# EAGLE design STM32_esc (EAGLE 9.6.2)
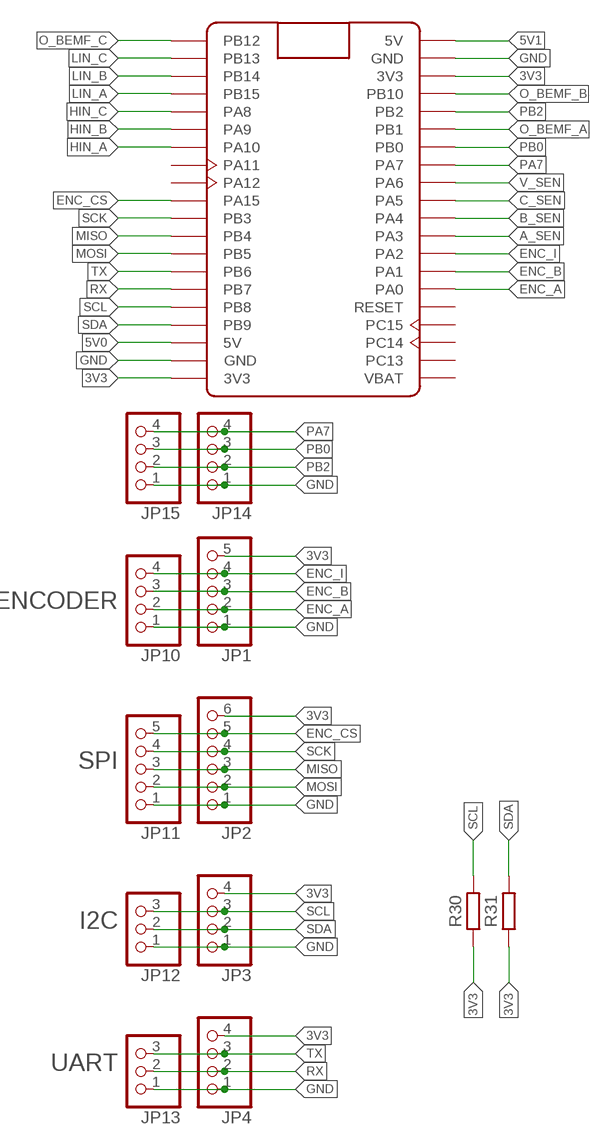
[diagram p0: schematic, sheet 1, part 1 of 2]
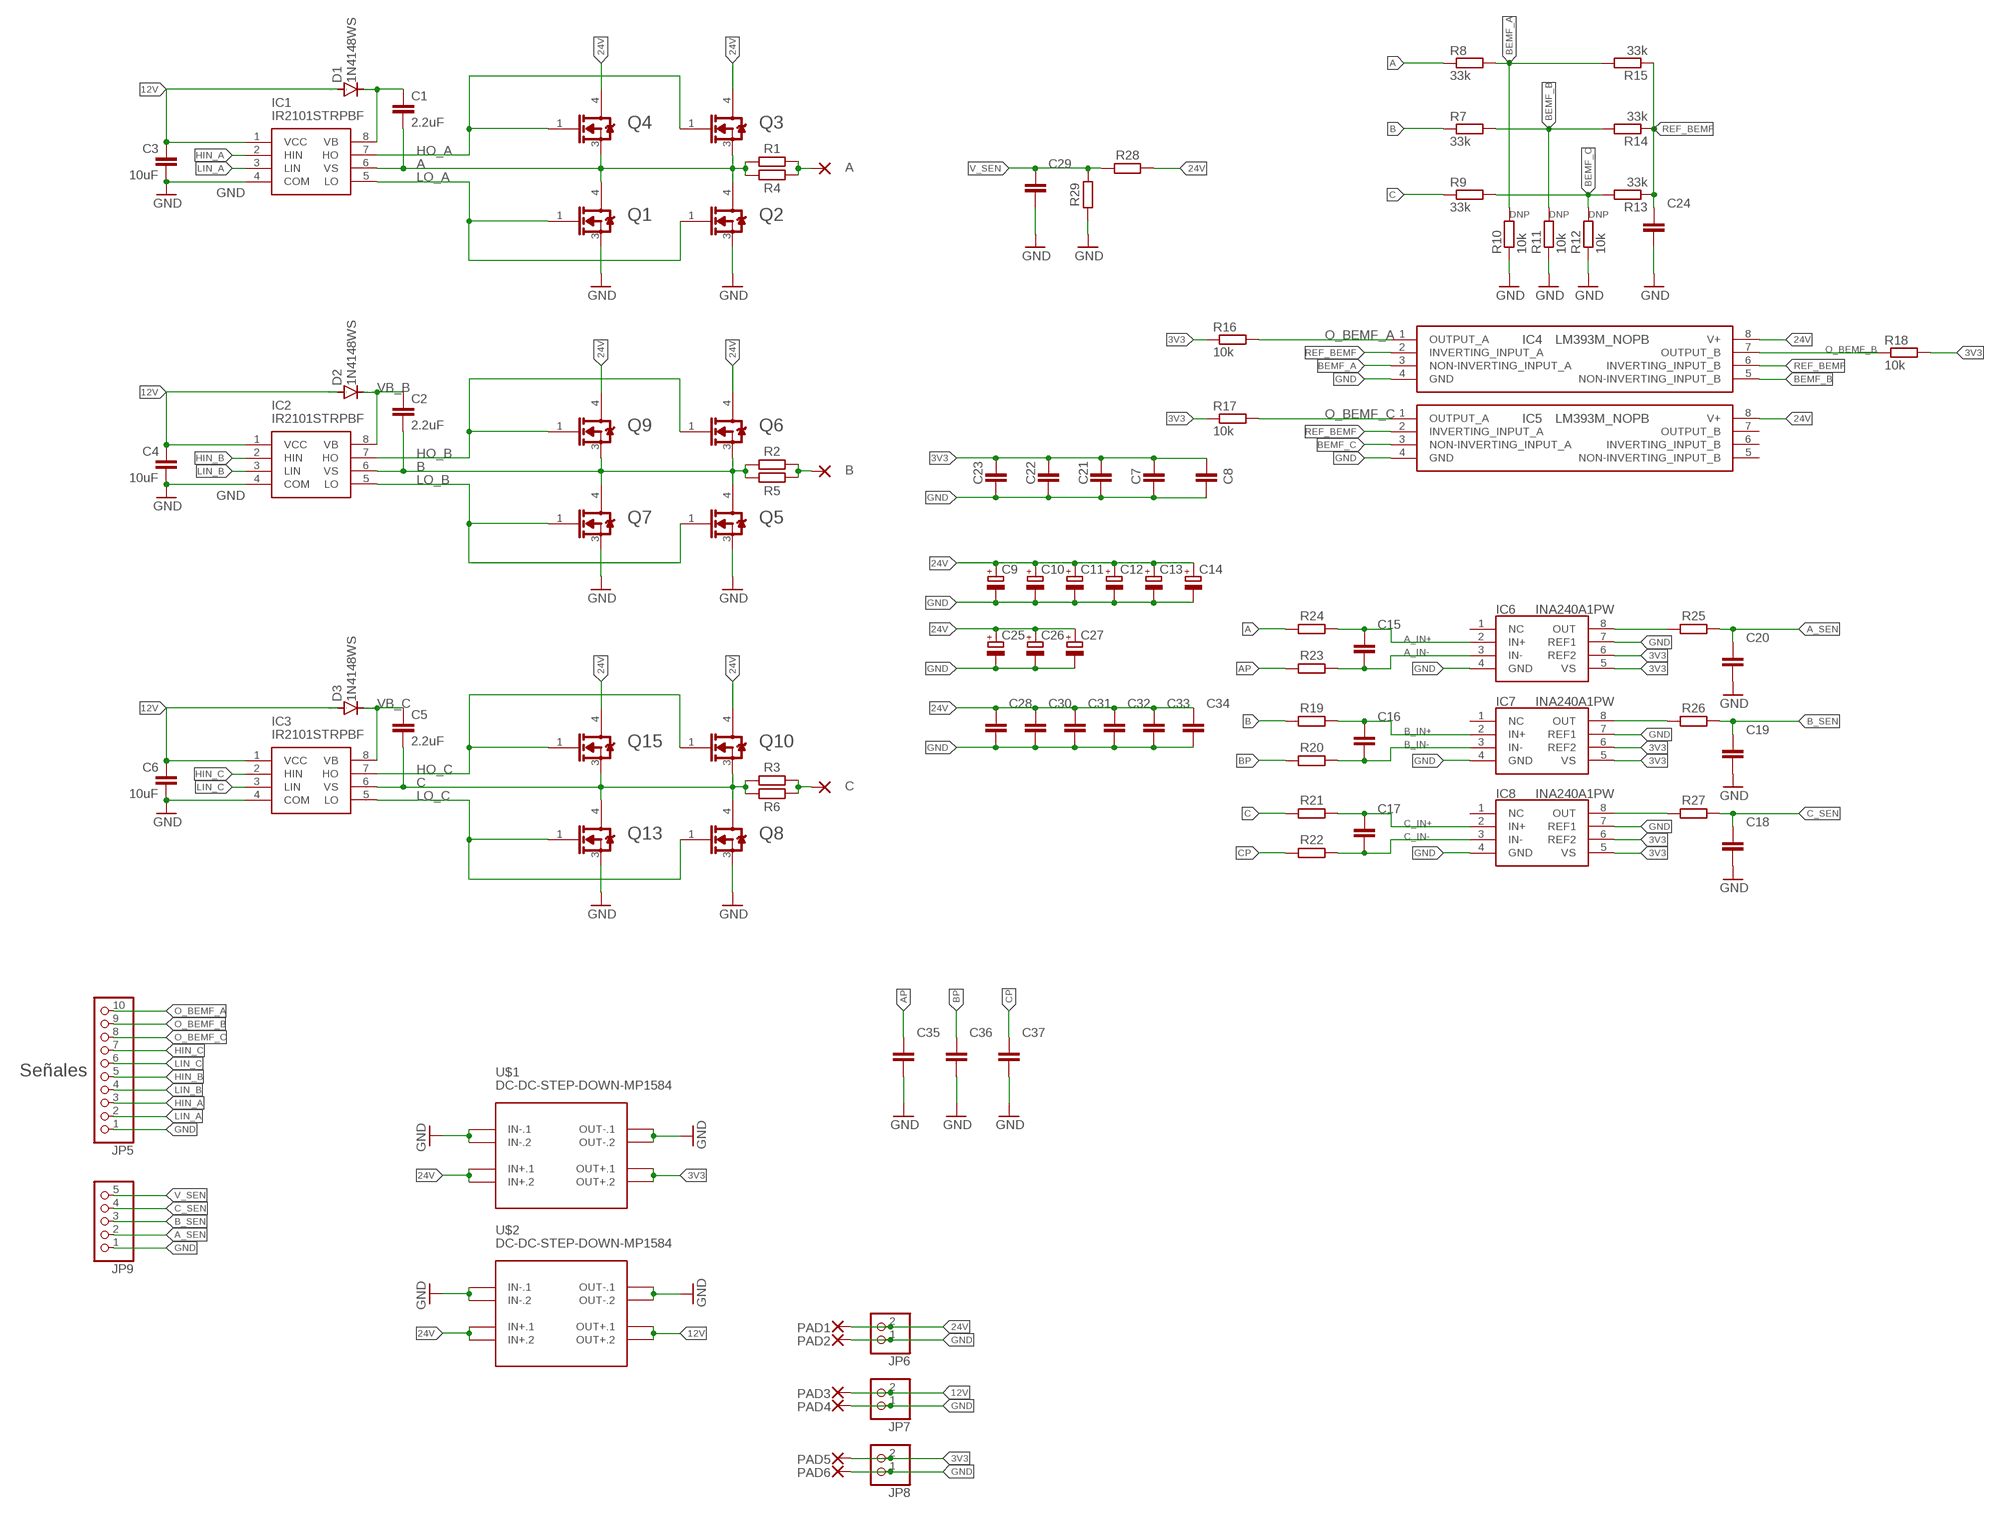
[diagram p1: schematic, sheet 1, part 2 of 2]

## Parts
A  SMD5  [SMD2,54-5,08]
B  SMD5  [SMD2,54-5,08]
C  SMD5  [SMD2,54-5,08]
C1  2.2uF  C_CHIP-1206(3216-METRIC)  [CAPC3216X135]
C2  2.2uF  C_CHIP-1206(3216-METRIC)  [CAPC3216X135]
C3  10uF  C_CHIP-1206(3216-METRIC)  [CAPC3216X135]
C4  10uF  C_CHIP-1206(3216-METRIC)  [CAPC3216X135]
C5  2.2uF  C_CHIP-1206(3216-METRIC)  [CAPC3216X135]
C6  10uF  C_CHIP-1206(3216-METRIC)  [CAPC3216X135]
C7  C_CHIP-0603(1608-METRIC)  [0603]
C8  C_CHIP-0603(1608-METRIC)  [0603]
C9  C-POL_TANTALUM-2917(7343-METRIC)  [CAPMP7343X310N]
C10  C-POL_TANTALUM-2917(7343-METRIC)  [CAPMP7343X310N]
C11  C-POL_TANTALUM-2917(7343-METRIC)  [CAPMP7343X310N]
C12  C-POL_TANTALUM-2917(7343-METRIC)  [CAPMP7343X310N]
C13  C-POL_TANTALUM-2917(7343-METRIC)  [CAPMP7343X310N]
C14  C-POL_TANTALUM-2917(7343-METRIC)  [CAPMP7343X310N]
C15  C_CHIP-0603(1608-METRIC)  [0603]
C16  C_CHIP-0603(1608-METRIC)  [0603]
C17  C_CHIP-0603(1608-METRIC)  [0603]
C18  C_CHIP-0603(1608-METRIC)  [0603]
C19  C_CHIP-0603(1608-METRIC)  [0603]
C20  C_CHIP-0603(1608-METRIC)  [0603]
C21  C_CHIP-0603(1608-METRIC)  [0603]
C22  C_CHIP-0603(1608-METRIC)  [0603]
C23  C_CHIP-0603(1608-METRIC)  [0603]
C24  C_CHIP-0603(1608-METRIC)  [0603]
C25  C-POL_ECAP-10.5MM  [CAPAE1030X1050N]
C26  C-POL_ECAP-10.5MM  [CAPAE1030X1050N]
C27  C-POL_ECAP-10.5MM  [CAPAE1030X1050N]
C28  C_CHIP-1206(3216-METRIC)  [1206]
C29  C_CHIP-0603(1608-METRIC)  [0603]
C30  C_CHIP-1206(3216-METRIC)  [1206]
C31  C_CHIP-1206(3216-METRIC)  [1206]
C32  C_CHIP-1206(3216-METRIC)  [1206]
C33  C_CHIP-1206(3216-METRIC)  [1206]
C34  C_CHIP-1206(3216-METRIC)  [1206]
C35  C_CHIP-1206(3216-METRIC)  [1206]
C36  C_CHIP-1206(3216-METRIC)  [1206]
C37  C_CHIP-1206(3216-METRIC)  [1206]
D1  1N4148WS  1N4446  [DO35-10]
D2  1N4148WS  1N4446  [DO35-10]
D3  1N4148WS  1N4446  [DO35-10]
IC1  IR2101STRPBF  [SOIC127P600X175-8N]
IC2  IR2101STRPBF  [SOIC127P600X175-8N]
IC3  IR2101STRPBF  [SOIC127P600X175-8N]
IC4  LM393M_NOPB  [SOIC127P600X175-8N]
IC5  LM393M_NOPB  [SOIC127P600X175-8N]
IC6  INA240A1PW  [SOP65P640X120-8N]
IC7  INA240A1PW  [SOP65P640X120-8N]
IC8  INA240A1PW  [SOP65P640X120-8N]
JP1  PINHD-1X5  [1X05]
JP2  PINHD-1X6  [1X06]
JP3  PINHD-1X4  [1X04]
JP4  PINHD-1X4  [1X04]
JP5  PINHD-1X10  [1X10]
JP6  PINHD-1X2  [1X02]
JP7  PINHD-1X2  [1X02]
JP8  PINHD-1X2  [1X02]
JP9  PINHD-1X5  [1X05]
JP10  PINHD-1X4  [1X04]
JP11  PINHD-1X5  [1X05]
JP12  PINHD-1X3  [1X03]
JP13  PINHD-1X3  [1X03]
JP14  PINHD-1X4  [1X04]
JP15  PINHD-1X4  [1X04]
PAD1  PAD1.27X2.54  [SMD1,27-2,54]
PAD2  PAD1.27X2.54  [SMD1,27-2,54]
PAD3  PAD1.27X2.54  [SMD1,27-2,54]
PAD4  PAD1.27X2.54  [SMD1,27-2,54]
PAD5  PAD1.27X2.54  [SMD1,27-2,54]
PAD6  PAD1.27X2.54  [SMD1,27-2,54]
Q1  INFINEON_IRLR7843TRPBFINFINEON_IRLR7843TRPBF_0_0  [INFINEON_IRLR7843TRPBF_0]
Q2  INFINEON_IRLR7843TRPBFINFINEON_IRLR7843TRPBF_0_0  [INFINEON_IRLR7843TRPBF_0]
Q3  INFINEON_IRLR7843TRPBFINFINEON_IRLR7843TRPBF_0_0  [INFINEON_IRLR7843TRPBF_0]
Q4  INFINEON_IRLR7843TRPBFINFINEON_IRLR7843TRPBF_0_0  [INFINEON_IRLR7843TRPBF_0]
Q5  INFINEON_IRLR7843TRPBFINFINEON_IRLR7843TRPBF_0_0  [INFINEON_IRLR7843TRPBF_0]
Q6  INFINEON_IRLR7843TRPBFINFINEON_IRLR7843TRPBF_0_0  [INFINEON_IRLR7843TRPBF_0]
Q7  INFINEON_IRLR7843TRPBFINFINEON_IRLR7843TRPBF_0_0  [INFINEON_IRLR7843TRPBF_0]
Q8  INFINEON_IRLR7843TRPBFINFINEON_IRLR7843TRPBF_0_0  [INFINEON_IRLR7843TRPBF_0]
Q9  INFINEON_IRLR7843TRPBFINFINEON_IRLR7843TRPBF_0_0  [INFINEON_IRLR7843TRPBF_0]
Q10  INFINEON_IRLR7843TRPBFINFINEON_IRLR7843TRPBF_0_0  [INFINEON_IRLR7843TRPBF_0]
Q13  INFINEON_IRLR7843TRPBFINFINEON_IRLR7843TRPBF_0_0  [INFINEON_IRLR7843TRPBF_0]
Q15  INFINEON_IRLR7843TRPBFINFINEON_IRLR7843TRPBF_0_0  [INFINEON_IRLR7843TRPBF_0]
R1  R_CHIP-2512(6332-METRIC)  [2512]
R2  R_CHIP-2512(6332-METRIC)  [2512]
R3  R_CHIP-2512(6332-METRIC)  [2512]
R4  R_CHIP-2512(6332-METRIC)  [2512]
R5  R_CHIP-2512(6332-METRIC)  [2512]
R6  R_CHIP-2512(6332-METRIC)  [2512]
R7  33k  R_CHIP-0603(1608-METRIC)  [0603]
R8  33k  R_CHIP-0603(1608-METRIC)  [0603]
R9  33k  R_CHIP-0603(1608-METRIC)  [0603]
R10  10k  R_CHIP-0603(1608-METRIC)  [0603]
R11  10k  R_CHIP-0603(1608-METRIC)  [0603]
R12  10k  R_CHIP-0603(1608-METRIC)  [0603]
R13  33k  R_CHIP-0603(1608-METRIC)  [0603]
R14  33k  R_CHIP-0603(1608-METRIC)  [0603]
R15  33k  R_CHIP-0603(1608-METRIC)  [0603]
R16  10k  R_CHIP-0603(1608-METRIC)  [0603]
R17  10k  R_CHIP-0603(1608-METRIC)  [0603]
R18  10k  R_CHIP-0603(1608-METRIC)  [0603]
R19  R_CHIP-0603(1608-METRIC)  [0603]
R20  R_CHIP-0603(1608-METRIC)  [0603]
R21  R_CHIP-0603(1608-METRIC)  [0603]
R22  R_CHIP-0603(1608-METRIC)  [0603]
R23  R_CHIP-0603(1608-METRIC)  [0603]
R24  R_CHIP-0603(1608-METRIC)  [0603]
R25  R_CHIP-0603(1608-METRIC)  [0603]
R26  R_CHIP-0603(1608-METRIC)  [0603]
R27  R_CHIP-0603(1608-METRIC)  [0603]
R28  R_CHIP-0603(1608-METRIC)  [0603]
R29  R_CHIP-0603(1608-METRIC)  [0603]
R30  R_CHIP-0603(1608-METRIC)  [0603]
R31  R_CHIP-0603(1608-METRIC)  [0603]
U1  STM32F4X1  [BLACK_PILL]
U$1  DC-DC-STEP-DOWN-MP1584  [DC-DC-STEP-DOWN-MP1584]
U$2  DC-DC-STEP-DOWN-MP1584  [DC-DC-STEP-DOWN-MP1584]

## Nets
3V3: C7.1 C8.1 C21.1 C22.1 C23.1 IC6.5(VS) IC6.6(REF2) IC7.5(VS) IC7.6(REF2) IC8.5(VS) IC8.6(REF2) JP1.5 JP2.6 JP3.4 JP4.4 JP8.2 PAD5.1(P) R16.1 R17.1 R18.2 R30.1 R31.1 U1.P$20(3.3V1) U1.P$23(3V3) U$1.OUT+.1 U$1.OUT+.2
5V0: U1.P$18(5V)
5V1: U1.P$21(5V0)
12V: C3.2 C4.2 C6.2 D1.A D2.A D3.A IC1.1(VCC) IC2.1(VCC) IC3.1(VCC) JP7.2 PAD3.1(P) U$2.OUT+.1 U$2.OUT+.2
24V: C9.1(+) C10.1(+) C11.1(+) C12.1(+) C13.1(+) C14.1(+) C25.1(+) C26.1(+) C27.1(+) C28.1 C30.1 C31.1 C32.1 C33.1 C34.1 IC4.8(V+) IC5.8(V+) JP6.2 PAD1.1(P) Q3.4(DRAIN) Q4.4(DRAIN) Q6.4(DRAIN) Q9.4(DRAIN) Q10.4(DRAIN) Q15.4(DRAIN) R28.2 U$1.IN+.1 U$1.IN+.2 U$2.IN+.1 U$2.IN+.2
A: C1.2 IC1.6(VS) Q1.4(DRAIN) Q2.4(DRAIN) Q3.3(SOURCE) Q4.3(SOURCE) R1.1 R4.2 R8.1 R24.1
A_IN+: C15.1 IC6.2(IN+) R24.2
A_IN-: C15.2 IC6.3(IN-) R23.2
A_OUT_SEN: IC6.8(OUT) R25.1
A_SEN: C20.1 JP9.2 R25.2 U1.P$32(PA3)
AP: A.1(P) C35.1 R1.2 R4.1 R23.1
B: C2.2 IC2.6(VS) Q5.4(DRAIN) Q6.3(SOURCE) Q7.4(DRAIN) Q9.3(SOURCE) R2.1 R5.2 R7.1 R19.1
B_IN+: C16.1 IC7.2(IN+) R19.2
B_IN-: C16.2 IC7.3(IN-) R20.2
B_OUT_SEN: IC7.8(OUT) R26.1
B_SEN: C19.1 JP9.3 R26.2 U1.P$31(PA4)
BEMF_A: IC4.3(NON-INVERTING_INPUT_A) R8.2 R10.2 R15.2
BEMF_B: IC4.5(NON-INVERTING_INPUT_B) R7.2 R11.2 R14.2
BEMF_C: IC5.3(NON-INVERTING_INPUT_A) R9.2 R12.2 R13.2
BP: B.1(P) C36.1 R2.2 R5.1 R20.1
C: C5.2 IC3.6(VS) Q8.4(DRAIN) Q10.3(SOURCE) Q13.4(DRAIN) Q15.3(SOURCE) R3.1 R6.2 R9.1 R21.1
C_IN+: C17.1 IC8.2(IN+) R21.2
C_IN-: C17.2 IC8.3(IN-) R22.2
C_OUT_SEN: IC8.8(OUT) R27.1
C_SEN: C18.1 JP9.4 R27.2 U1.P$30(PA5)
CP: C37.1 C.1(P) R3.2 R6.1 R22.1
ENC_A: JP1.2 JP10.2 U1.P$35(PA0)
ENC_B: JP1.3 JP10.3 U1.P$34(PA1)
ENC_CS: JP2.5 JP11.5 U1.P$10(PA15)
ENC_I: JP1.4 JP10.4 U1.P$33(PA2)
GND: C3.1 C4.1 C6.1 C7.2 C8.2 C9.2(-) C10.2(-) C11.2(-) C12.2(-) C13.2(-) C14.2(-) C18.2 C19.2 C20.2 C21.2 C22.2 C23.2 C24.2 C25.2(-) C26.2(-) C27.2(-) C28.2 C29.2 C30.2 C31.2 C32.2 C33.2 C34.2 C35.2 C36.2 C37.2 IC1.4(COM) IC2.4(COM) IC3.4(COM) IC4.4(GND) IC5.4(GND) IC6.4(GND) IC6.7(REF1) IC7.4(GND) IC7.7(REF1) IC8.4(GND) IC8.7(REF1) JP1.1 JP2.1 JP3.1 JP4.1 JP5.1 JP6.1 JP7.1 JP8.1 JP9.1 JP10.1 JP11.1 JP12.1 JP13.1 JP14.1 JP15.1 PAD2.1(P) PAD4.1(P) PAD6.1(P) Q1.3(SOURCE) Q2.3(SOURCE) Q5.3(SOURCE) Q7.3(SOURCE) Q8.3(SOURCE) Q13.3(SOURCE) R10.1 R11.1 R12.1 R29.1 U1.P$19(GND2) U1.P$22(GND) U$1.IN-.1 U$1.IN-.2 U$1.OUT-.1 U$1.OUT-.2 U$2.IN-.1 U$2.IN-.2 U$2.OUT-.1 U$2.OUT-.2
HIN_A: IC1.2(HIN) JP5.3 U1.P$7(PA10)
HIN_B: IC2.2(HIN) JP5.5 U1.P$6(PA9)
HIN_C: IC3.2(HIN) JP5.7 U1.P$5(PA8)
HO_A: IC1.7(HO) Q3.1(GATE) Q4.1(GATE)
HO_B: IC2.7(HO) Q6.1(GATE) Q9.1(GATE)
HO_C: IC3.7(HO) Q10.1(GATE) Q15.1(GATE)
LIN_A: IC1.3(LIN) JP5.2 U1.P$4(PB15)
LIN_B: IC2.3(LIN) JP5.4 U1.P$3(PB14)
LIN_C: IC3.3(LIN) JP5.6 U1.P$2(PB13)
LO_A: IC1.5(LO) Q1.1(GATE) Q2.1(GATE)
LO_B: IC2.5(LO) Q5.1(GATE) Q7.1(GATE)
LO_C: IC3.5(LO) Q8.1(GATE) Q13.1(GATE)
MISO: JP2.3 JP11.3 U1.P$12(PB4)
MOSI: JP2.2 JP11.2 U1.P$13(PB5)
O_BEMF_A: IC4.1(OUTPUT_A) JP5.10 R16.2 U1.P$26(PB1)
O_BEMF_B: IC4.7(OUTPUT_B) JP5.9 R18.1 U1.P$24(PB10)
O_BEMF_C: IC5.1(OUTPUT_A) JP5.8 R17.2 U1.P$1(PB12)
PA7: JP14.4 JP15.4 U1.P$28(PA7)
PB0: JP14.3 JP15.3 U1.P$27(PB0)
PB2: JP14.2 JP15.2 U1.P$25(PB2)
REF_BEMF: C24.1 IC4.2(INVERTING_INPUT_A) IC4.6(INVERTING_INPUT_B) IC5.2(INVERTING_INPUT_A) R13.1 R14.1 R15.1
RX: JP4.2 JP13.2 U1.P$15(PB7)
SCK: JP2.4 JP11.4 U1.P$11(PB3)
SCL: JP3.3 JP12.3 R30.2 U1.P$16(PB8)
SDA: JP3.2 JP12.2 R31.2 U1.P$17(PB9)
TX: JP4.3 JP13.3 U1.P$14(PB6)
V_SEN: C29.1 JP9.5 R28.1 R29.2 U1.P$29(PA6)
VB_A: C1.1 D1.C IC1.8(VB)
VB_B: C2.1 D2.C IC2.8(VB)
VB_C: C5.1 D3.C IC3.8(VB)
Unconnected: IC5.5(NON-INVERTING_INPUT_B) IC5.6(INVERTING_INPUT_B) IC5.7(OUTPUT_B) IC6.1(NC) IC7.1(NC) IC8.1(NC) U1.P$8(PA11) U1.P$9(PA12) U1.P$36(RESET) U1.P$37(PC15) U1.P$38(PC14) U1.P$39(PC13)

## Notes on the sheet
- ENCODER
- SPI
- I2C
- UART | Señales

## Power pins joined to a net without a drawn wire
VBAT: U1.P$40(VBAT)

## Library data of the parts
A B C = wirepad:SMD5: SMD PAD
C1-C6 = Capacitor:C: Capacitor - Generic; CATEGORY: Capacitor
C7 C8 C15-C24 C28-C37 = Capacitor_edit:C: Capacitor - Generic; CATEGORY: Capacitor
C9-C14 C25-C27 = Capacitor:C-POL: Capacitor Polarised - Generic; CATEGORY: Capacitor
D1-D3 = diode:1N4446: DIODE high speed (Philips)
IC1-IC3 = IR2101STRPBF:IR2101STRPBF: High and Low Side Driver SOIC8 Infineon IR2101STRPBF, Dual MOSFET Power Driver, 360mA, 10 20 V, Non-Inverting, 8-Pin SOIC Source: Datasheet <http://uk.rs-online.com/web/p/products/1248778>; ARROW_PART_NUMBER: IR2101STRPBF; ARROW_PRICE-STOCK: https://www.arrow.com/en/products/ir2101strpbf/infineon-technologies-ag; DESCRIPTION: High and Low Side Driver SOIC8 Infineon IR2101STRPBF, Dual MOSFET Power Driver, 360mA, 10 20 V, Non-Inverting, 8-Pin SOIC; HEIGHT: 1.75mm; MANUFACTURER_NAME: Infineon; MANUFACTURER_PART_NUMBER: IR2101STRPBF; MOUSER_PART_NUMBER: 942-IR2101STRPBF; MOUSER_PRICE-STOCK: https://www.mouser.co.uk/ProductDetail/Infineon-IR/IR2101STRPBF/?qs=ellYJlE8XiER7yumWzaY8w%3D%3D
IC4 IC5 = LM393M_NOPB:LM393M_NOPB: Low Power Low Offset Voltage Dual Comparator Source: Datasheet <https://www.ti.com/lit/ds/symlink/lm193-n.pdf?HQS=TI-null-null-digikeymode-df-pf-null-wwe&ts=1593083265253>; ARROW_PART_NUMBER: LM393M/NOPB; ARROW_PRICE-STOCK: https://www.arrow.com/en/products/lm393mnopb/texas-instruments; DESCRIPTION: Low Power Low Offset Voltage Dual Comparator; HEIGHT: 1.75mm; MANUFACTURER_NAME: Texas Instruments; MANUFACTURER_PART_NUMBER: LM393M/NOPB; MOUSER_PART_NUMBER: 926-LM393M/NOPB; MOUSER_PRICE-STOCK: https://www.mouser.co.uk/ProductDetail/Texas-Instruments/LM393M-NOPB/?qs=QbsRYf82W3GpBNun7wKZlw%3D%3D
IC6-IC8 = INA240A1PW:INA240A1PW: Current Sense Amplifiers Voltage Output, High or Low Side Measurement, Bi-Directional Zer?-Drift Series 8-TSSOP -40 to 125 Source: Datasheet <http://www.ti.com/general/docs/lit/getliterature.tsp?genericPartNumber=ina240&fileType=pdf>; DESCRIPTION: Current Sense Amplifiers Voltage Output, High or Low Side Measurement, Bi-Directional Zer?-Drift Series 8-TSSOP -40 to 125; HEIGHT: 1.2mm; MANUFACTURER_NAME: Texas Instruments; MANUFACTURER_PART_NUMBER: INA240A1PW; MOUSER_PART_NUMBER: 595-INA240A1PW; MOUSER_PRICE-STOCK: https://www.mouser.co.uk/ProductDetail/Texas-Instruments/INA240A1PW?qs=aVyJF2WnouQ4CUqAxLDbhw%3D%3D
JP1 JP9 JP11 = pinhead:PINHD-1X5: PIN HEADER
JP2 = pinhead:PINHD-1X6: PIN HEADER
JP3 JP4 JP10 JP14 JP15 = pinhead:PINHD-1X4: PIN HEADER
JP5 = pinhead:PINHD-1X10: PIN HEADER
JP6-JP8 = pinhead:PINHD-1X2: PIN HEADER
JP12 JP13 = pinhead:PINHD-1X3: PIN HEADER
PAD1-PAD6 = wirepad_edit:PAD
Q1-Q10 Q13 Q15 = Infineon - IRLR7843TRPBF:INFINEON_IRLR7843TRPBF: N-Channel 30V 161A (Tc) 140W (Tc) Surface Mount D-Pak; AUTOMOTIVE: No; CENTROID_NOT_SPECIFIED: Yes; CONTINUOUS_DRAIN_CURRENT: 161A; DATASHEET: https://www.infineon.com/dgdl/irlr7843pbf.pdf?fileId=5546d462533600a40153566de53526d8; DEPLETION_MODE: False; DEVICE_CLASS_L1: Discrete Semiconductors; DEVICE_CLASS_L2: Transistors; DEVICE_CLASS_L3: MOSFETs; DIGIKEY_DESCRIPTION: MOSFET N-CH 30V 161A DPAK; DIGIKEY_PART_NUMBER: IRLR7843PBFCT-ND; DRAIN_TO_SOURCE_BREAKDOWN_VOLTAGE: 30V; DRAIN_TO_SOURCE_RESISTANCE: 3.2mΩ; DRAIN_TO_SOURCE_VOLTAGE: 30V; FOOTPRINT_URL: https://www.infineon.com/cms/en/product/packages/PG-TO252/PG-TO252-3-901/; FOOTPRINT_VARIANT_NAME_0: Recommended_Land_Pattern; GATE_CHARGE_AT_VGS: 34nC @ 4.5V; GATE_TO_SOURCE_VOLTAGE: 20V; HEIGHT: 2.52mm; INPUT_CAPACITACE_AT_VDS: 4380pF @ 15V; LEAD_FREE: Yes; MAX_FORWARD_DIODE_VOLTAGE: 1V; MAX_JUNCTION_TEMP: +175°C; MF: Infineon; MFG_PACKAGE_IDENT: PG-TO252-3; MFG_PACKAGE_IDENT_COMPONENT_ID: d9d1000c4571b64f; MFG_PACKAGE_IDENT_DATE: 0; MFG_PACKAGE_IDENT_REV: 901; MOUSER_PART_NUMBER: 942-IRLR7843TRPBF; MPN: IRLR7843TRPBF; NUMBER_OF_CHANNELS: 1; NUMBER_OF_N_CHANNELS: 1; PACKAGE: TO252-3; POWER_DISSIPATION: 140W; PREFIX: Q; PULSE_DRAIN_CURRENT: 620A; REVERSE_RECOVERY_CHARGE: 36nC; REVERSE_RECOVERY_TIME: 39ns; ROHS: Yes; RTHJA_MAX: 50°C/W; TEMPERATURE_RANGE_HIGH: +175°C; TEMPERATURE_RANGE_LOW: -55°C; THRESHOLD_VGS_MAX: 2.3V; THRESHOLD_VGS_MIN: 1.4V; TURN_OFF_DELAY_TIME: 34ns; TURN_ON_DELAY_TIME: 25ns; VERIFICATION_VERSION: 0.0.0.3
R1-R31 = Resistor_edit:R: Resistor Fixed - Generic; CATEGORY: Resistor; SUB-CATEGORY: Fixed
U1 = STM32 Boards:STM32F4X1
U$1 U$2 = diy-modules:DC-DC-STEP-DOWN-MP1584: DC/DC Step-Down Regulator based on MP1584 chip MP1584 datasheet available here: http://www.haoyuelectronics.com/Attachment/MP1584/MP1584.pdf Click here to find device on ebay.com <http://www.ebay.com/sch/mp1584+module>

## Board
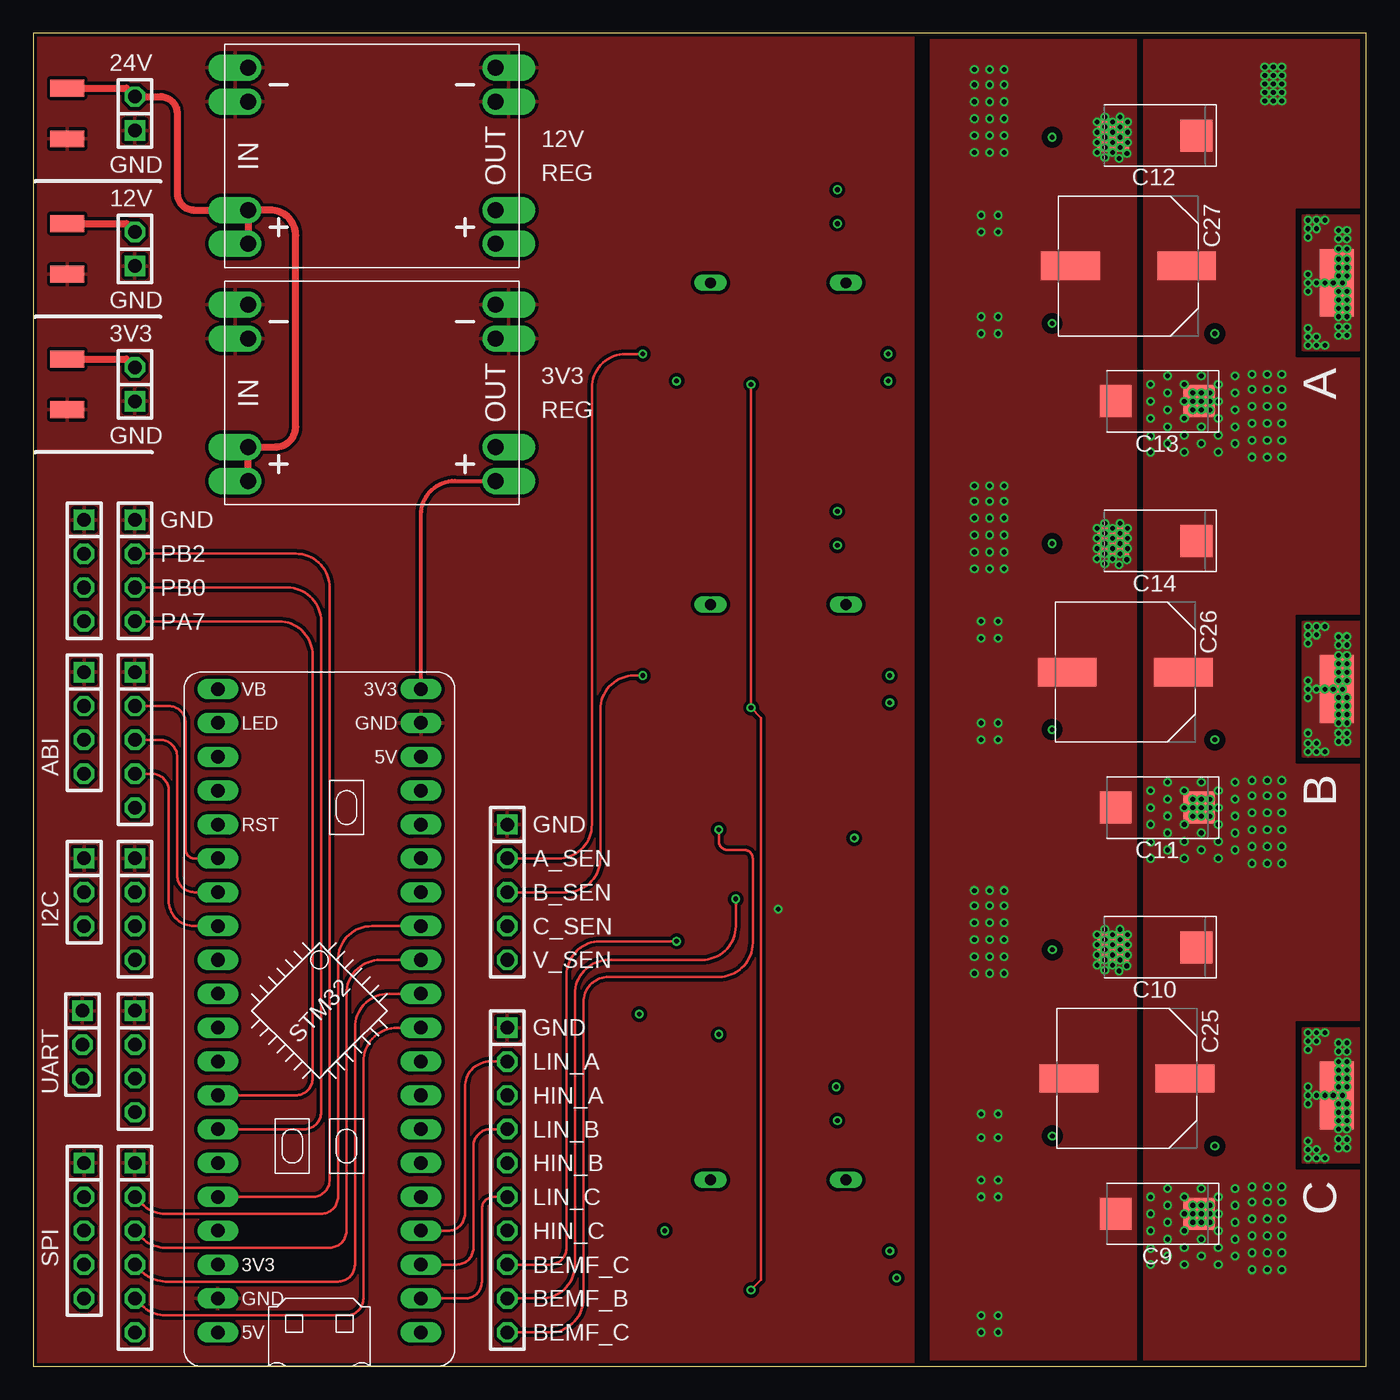
[diagram p2: board, top side]
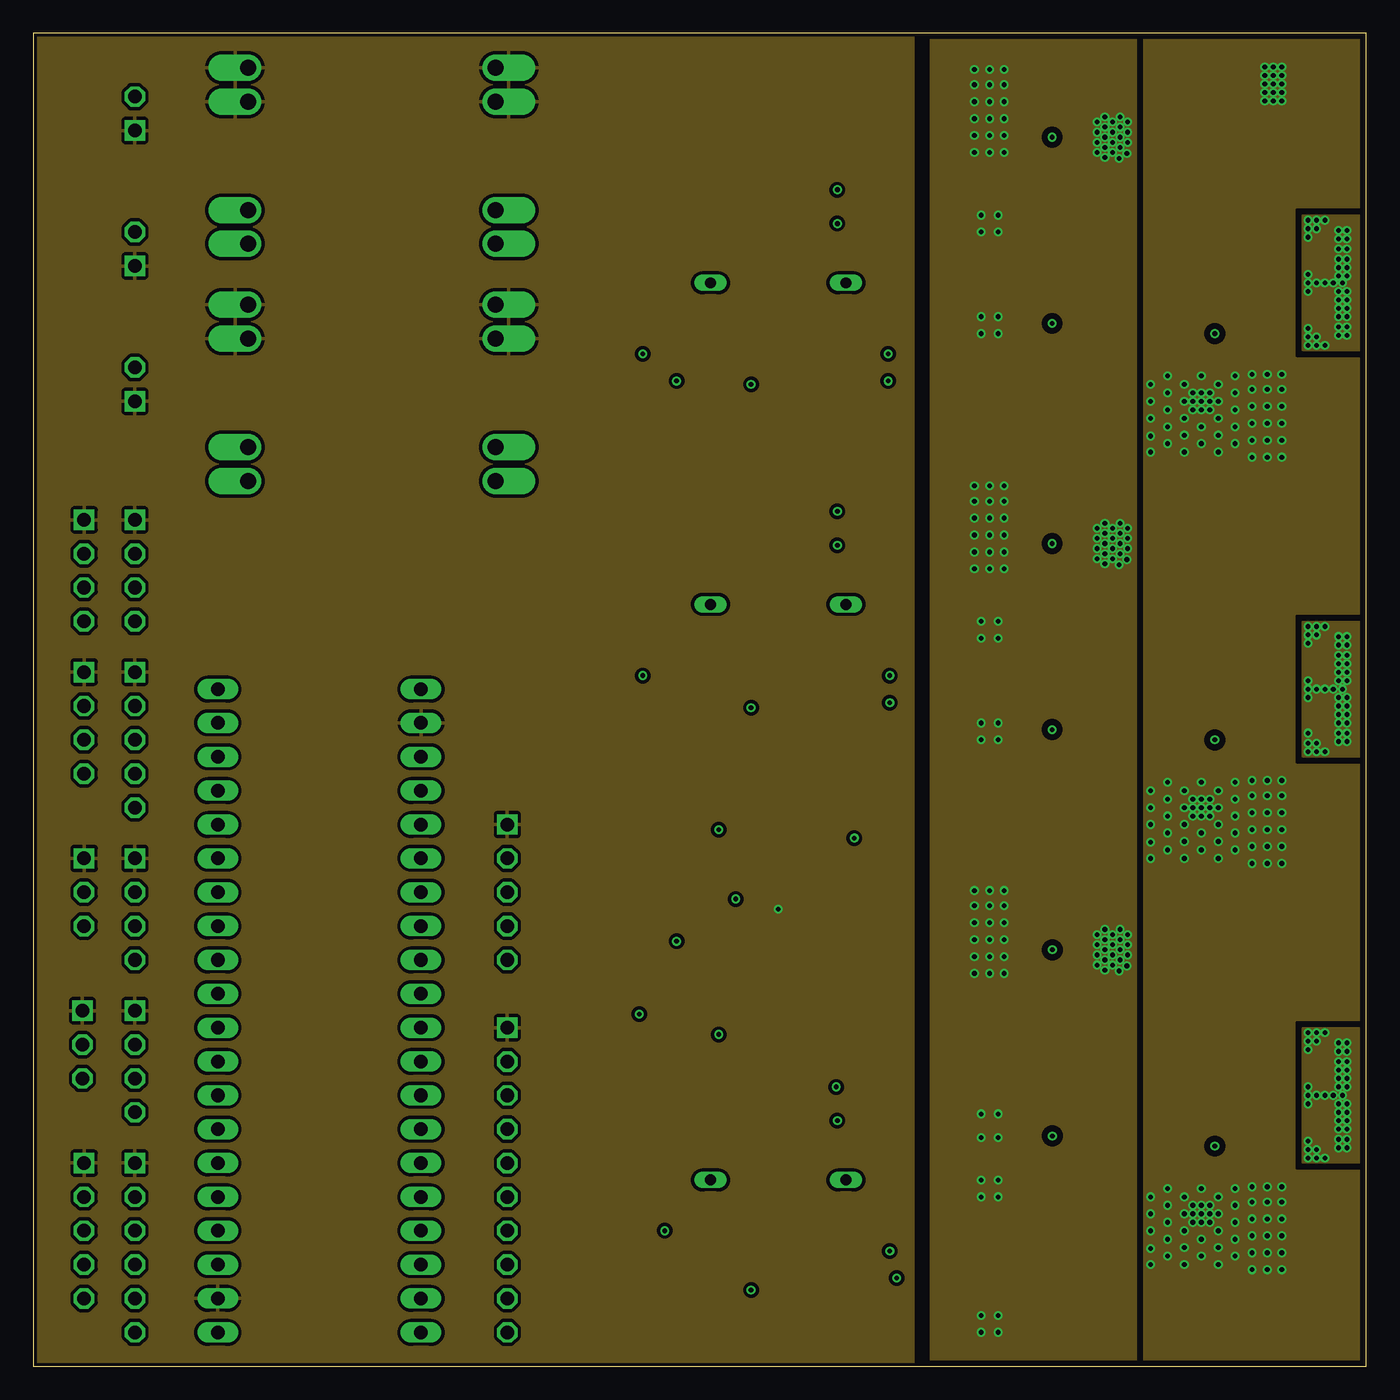
[diagram p3: board, inner layer Route2]
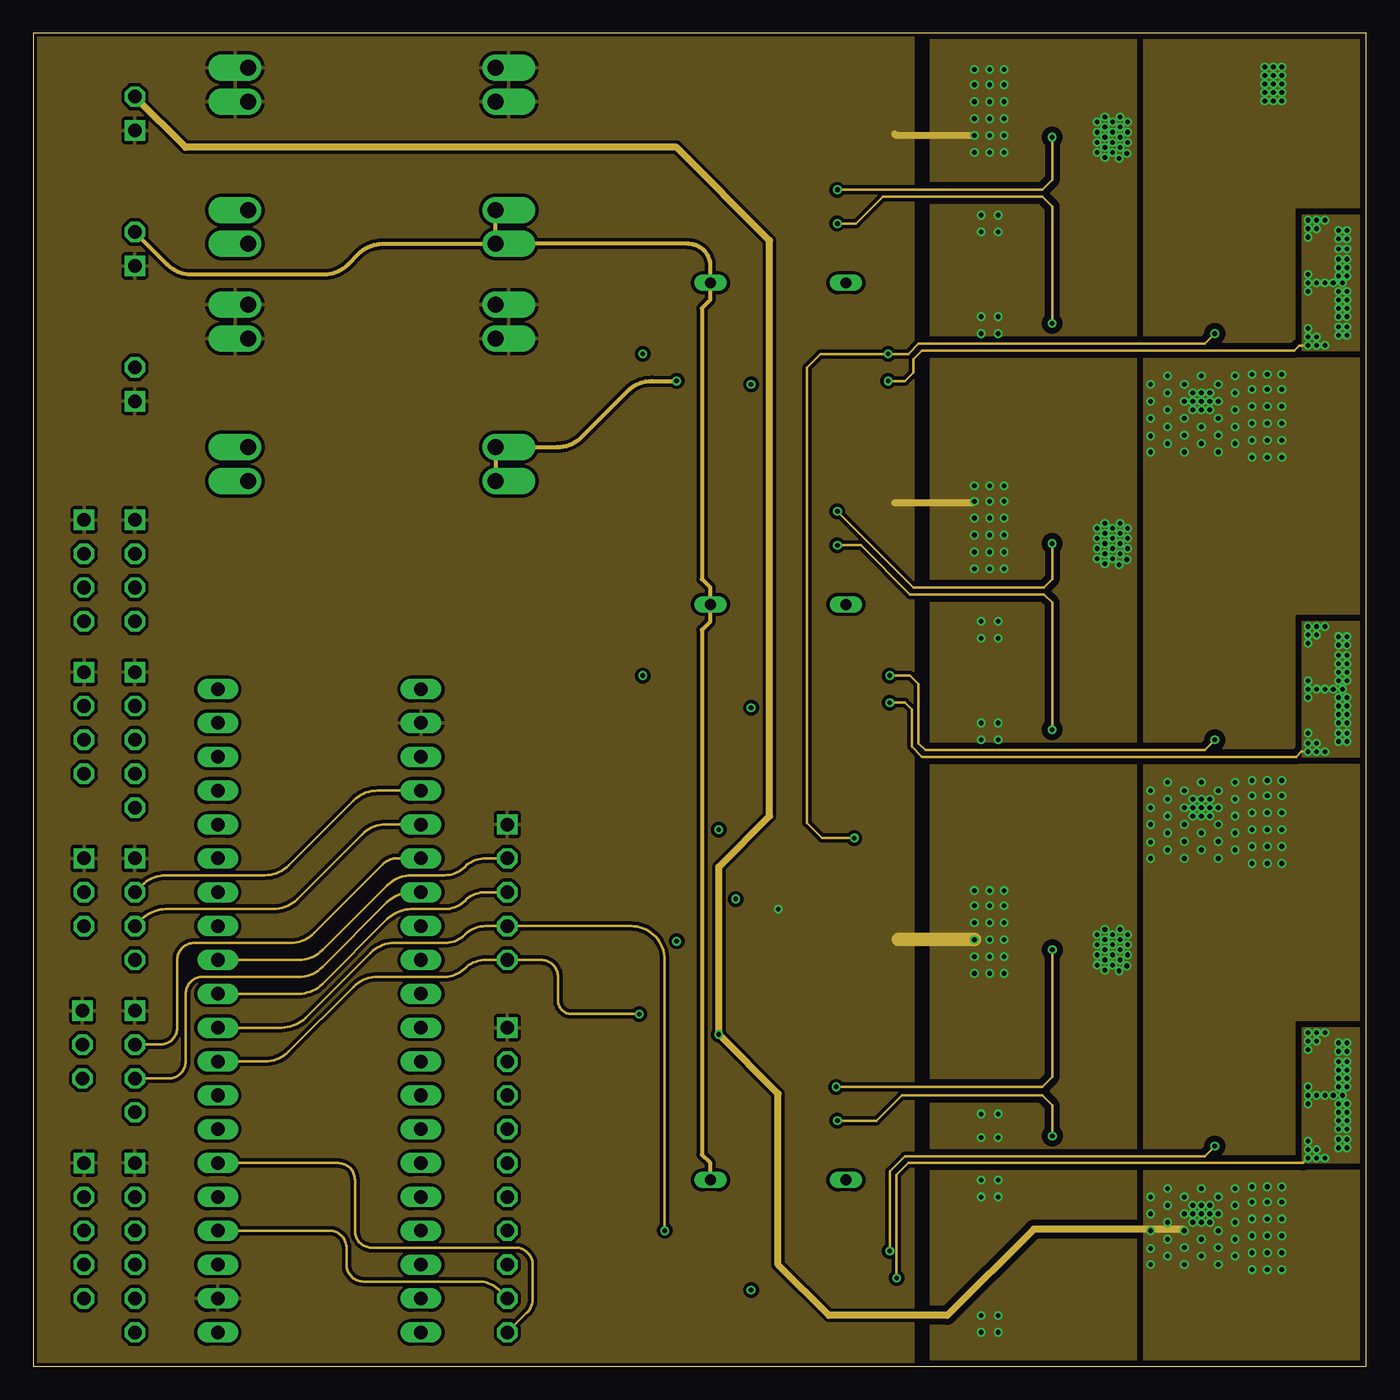
[diagram p4: board, inner layer Route15]
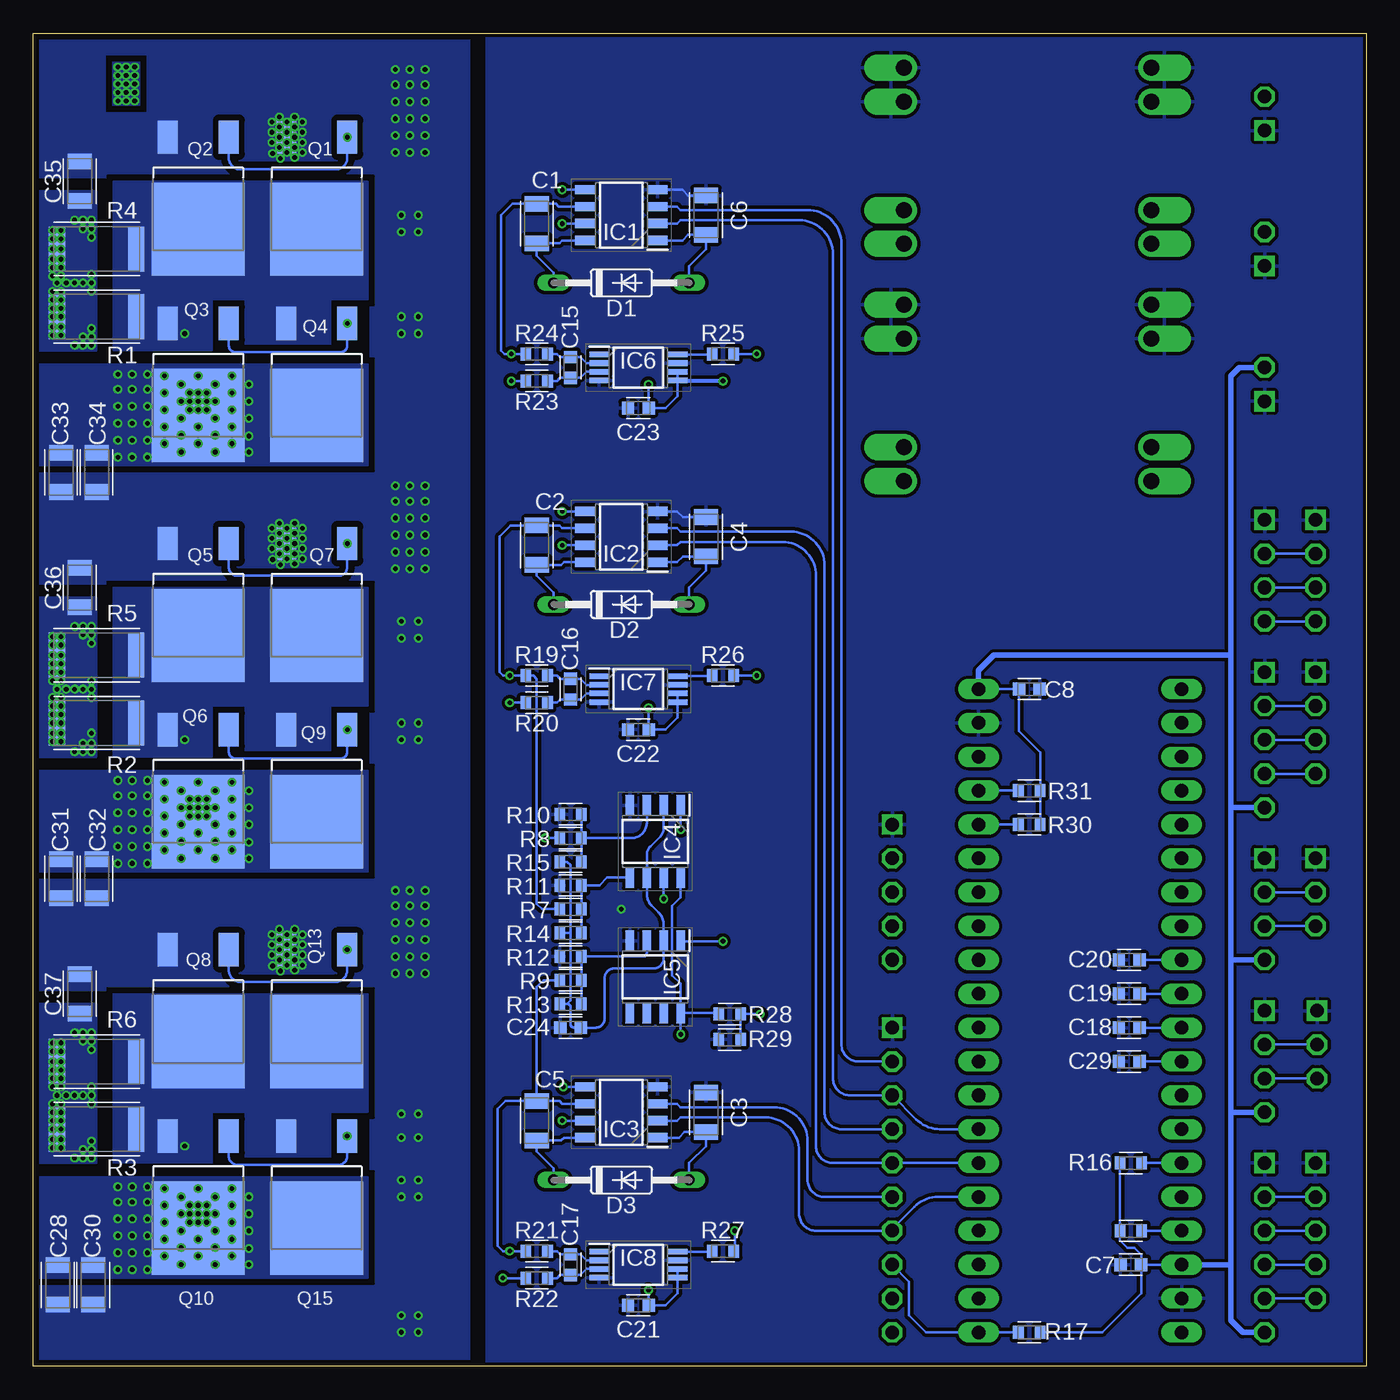
[diagram p5: board, bottom side, seen from below]

Size 100 x 100 mm. Coordinates in mm from the lower left corner, seen from the top.
Outline: 0,0 100,0 100,100 0,100 0,0
Copper layers (1*2*15*16): Top 0.035559375mm / dielectric 0.17018125mm / Route2 0.01778125mm / dielectric 47mil / Route15 0.01778125mm / dielectric 0.17018125mm / Bottom 0.035559375mm
Design rules "jlcpcb-4-layer *": minimum track width 5mil, minimum drill 0.2mm, track to track 0.1mm, track to pad 0.1mm, pad to pad 0.22mm, via to via 0.22mm, smd to smd 0mil, copper to edge 0.1mm, drill to drill 11mil, minimum pad ring 6mil, minimum via ring 6mil, stop-mask expansion 3mil, vias tented up to drill 100mil, thermal gap 10mil

### Footprints (pad centres in the part's own frame; a part is rotated, then mirrored left to right if it is on the bottom)
SMD2,54-5,08 = smd 2.54 x 5.08: 1 0,0
CAPC3216X135 = smd 1.165 x 1.815: 1 -1.475,0; 2 1.475,0
0603 = smd 0.921 x 0.97: 1 -0.775,0; 2 0.775,0
CAPMP7343X310N = smd 2.368 x 2.404: 1 -3.121,0; 2 3.121,0
CAPAE1030X1050N = smd 4.416 x 2.115: 1 -4.353,0; 2 4.353,0
1206 = smd 1.165 x 1.815: 1 -1.475,0; 2 1.475,0
DO35-10 = drill 0.813 long: A 5.08,0; C -5.08,0
SOIC127P600X175-8N = smd 1.525 x 0.7: 1 -2.712,1.905; 2 -2.712,0.635; 3 -2.712,-0.635; 4 -2.712,-1.905; 5 2.712,-1.905; 6 2.712,-0.635; 7 2.712,0.635; 8 2.712,1.905
SOIC127P600X175-8N' = smd 1.528 x 0.65: 1 -2.711,1.905; 2 -2.711,0.635; 3 -2.711,-0.635; 4 -2.711,-1.905; 5 2.711,-1.905; 6 2.711,-0.635; 7 2.711,0.635; 8 2.711,1.905
SOP65P640X120-8N = smd 1.475 x 0.42: 1 -2.938,0.975; 2 -2.938,0.325; 3 -2.938,-0.325; 4 -2.938,-0.975; 5 2.938,-0.975; 6 2.938,-0.325; 7 2.938,0.325; 8 2.938,0.975
1X05 = drill 1.016 square: 1 -5.08,0 | drill 1.016 octagon: 2 -2.54,0; 3 0,0; 4 2.54,0; 5 5.08,0
1X06 = drill 1.016 square: 1 -6.35,0 | drill 1.016 octagon: 2 -3.81,0; 3 -1.27,0; 4 1.27,0; 5 3.81,0; 6 6.35,0
1X04 = drill 1.016 square: 1 -3.81,0 | drill 1.016 octagon: 2 -1.27,0; 3 1.27,0; 4 3.81,0
1X10 = drill 1.016 square: 1 -11.43,0 | drill 1.016 octagon: 2 -8.89,0; 3 -6.35,0; 4 -3.81,0; 5 -1.27,0; 6 1.27,0; 7 3.81,0; 8 6.35,0; 9 8.89,0; 10 11.43,0
1X02 = drill 1.016 square: 1 -1.27,0 | drill 1.016 octagon: 2 1.27,0
1X03 = drill 1.016 square: 1 -2.54,0 | drill 1.016 octagon: 2 0,0; 3 2.54,0
SMD1,27-2,54 = smd 1.27 x 2.54: 1 0,0
INFINEON_IRLR7843TRPBF_0 = smd 1.5 x 2.5: 1 -2.3,-4.575; 3 2.3,-4.575 | smd 7 x 7: 4 0,2.325
2512 = smd 1.231 x 3.37: 1 -2.97,0; 2 2.97,0
0603' = smd 0.799 x 0.974: 1 -0.815,0; 2 0.815,0
BLACK_PILL = drill 1.016 long: P$1 -7.62,24.13; P$2 -7.62,21.59; P$3 -7.62,19.05; P$4 -7.62,16.51; P$5 -7.62,13.97; P$6 -7.62,11.43; P$7 -7.62,8.89; P$8 -7.62,6.35; P$9 -7.62,3.81; P$10 -7.62,1.27; P$11 -7.62,-1.27; P$12 -7.62,-3.81; P$13 -7.62,-6.35; P$14 -7.62,-8.89; P$15 -7.62,-11.43; P$16 -7.62,-13.97; P$17 -7.62,-16.51; P$18 -7.62,-19.05; P$19 -7.62,-21.59; P$20 -7.62,-24.13; P$21 7.62,24.13; P$22 7.62,21.59; P$23 7.62,19.05; P$24 7.62,16.51; P$25 7.62,13.97; P$26 7.62,11.43; P$27 7.62,8.89; P$28 7.62,6.35; P$29 7.62,3.81; P$30 7.62,1.27; P$31 7.62,-1.27; P$32 7.62,-3.81; P$33 7.62,-6.35; P$34 7.62,-8.89; P$35 7.62,-11.43; P$36 7.62,-13.97; P$37 7.62,-16.51; P$38 7.62,-19.05; P$39 7.62,-21.59; P$40 7.62,-24.13
DC-DC-STEP-DOWN-MP1584 = drill 1.2 pad 2 offset: IN+.1 -9.271,-4.064; IN+.2 -9.271,-6.604; IN-.1 -9.271,6.604; IN-.2 -9.271,4.064; OUT+.1 9.271,-4.064; OUT+.2 9.271,-6.604; OUT-.1 9.271,6.604; OUT-.2 9.271,4.064

### Placement (x,y rotation side)
A  97.79,81.28 0 top
B  97.79,50.8 0 top
C  97.79,20.32 0 top
C1  62.23,85.72 90 bottom
C2  62.23,61.59 90 bottom
C3  49.53,19.05 270 bottom
C4  49.53,62.23 270 bottom
C5  62.23,18.41 90 bottom
C6  49.53,86.36 270 bottom
C7  17.65,7.62 180 bottom
C8  25.27,50.8 0 bottom
C9  84.33,11.43 180 top
C10  84.14,31.43 180 top
C11  84.33,41.91 180 top
C12  84.14,92.33 180 top
C13  84.33,72.39 180 top
C14  84.14,61.91 180 top
C15  59.69,74.93 270 bottom
C16  59.69,50.8 270 bottom
C17  59.69,7.62 270 bottom
C18  17.78,25.4 180 bottom
C19  17.78,27.94 180 bottom
C20  17.78,30.48 180 bottom
C21  54.61,4.57 180 bottom
C22  54.61,47.75 180 bottom
C23  54.61,71.88 180 bottom
C24  59.69,25.4 180 bottom
C25  82.04,21.59 180 top
C26  81.92,52.07 180 top
C27  82.17,82.55 180 top
C28  98.17,6.1 270 bottom
C29  17.78,22.86 180 bottom
C30  95.5,6.1 270 bottom
C31  97.92,36.58 270 bottom
C32  95.25,36.58 270 bottom
C33  97.92,67.06 270 bottom
C34  95.25,67.06 270 bottom
C35  96.52,88.9 90 bottom
C36  96.52,58.42 90 bottom
C37  96.52,27.94 90 bottom
D1  55.88,81.28 0 bottom
D2  55.88,57.15 0 bottom
D3  55.88,13.97 0 bottom
IC1  55.88,86.36 180 bottom
IC2  55.88,62.23 180 bottom
IC3  55.88,19.05 180 bottom
IC4  LM393M_NOPB  [SOIC127P600X175-8N']  53.34,39.37 270 bottom
IC5  LM393M_NOPB  [SOIC127P600X175-8N']  53.34,29.21 270 bottom
IC6  54.61,74.93 0 bottom
IC7  54.61,50.8 0 bottom
IC8  54.61,7.62 0 bottom
JP1  7.62,46.99 270 top
JP2  7.62,8.89 270 top
JP3  7.62,34.29 270 top
JP4  7.62,22.86 270 top
JP5  35.56,13.97 270 top
JP6  7.62,93.98 90 top
JP7  7.62,83.82 90 top
JP8  7.62,73.66 90 top
JP9  35.56,35.56 270 top
JP10  3.81,48.26 270 top
JP11  3.81,10.16 270 top
JP12  3.81,35.56 270 top
JP13  3.68,24.13 270 top
JP14  3.81,59.69 270 top
JP15  7.62,59.69 270 top
PAD1  2.54,95.89 90 top
PAD2  2.54,92.08 90 top
PAD3  2.54,85.72 90 top
PAD4  2.54,81.92 90 top
PAD5  2.54,75.56 90 top
PAD6  2.54,71.75 90 top
Q1  78.74,87.63 180 bottom
Q2  87.63,87.63 180 bottom
Q3  87.63,73.66 180 bottom
Q4  78.74,73.66 180 bottom
Q5  87.63,57.15 180 bottom
Q6  87.63,43.18 180 bottom
Q7  78.74,57.15 180 bottom
Q8  87.63,26.67 180 bottom
Q9  78.74,43.18 180 bottom
Q10  87.63,12.7 180 bottom
Q13  78.74,26.67 180 bottom
Q15  78.74,12.7 180 bottom
R1  95.25,78.74 180 bottom
R2  95.25,48.26 180 bottom
R3  95.25,17.78 180 bottom
R4  95.25,83.82 0 bottom
R5  95.25,53.34 0 bottom
R6  95.25,22.86 0 bottom
R7  33k  [0603']  59.69,34.29 0 bottom
R8  33k  [0603']  59.69,39.62 0 bottom
R9  33k  [0603']  59.69,28.96 0 bottom
R10  10k  [0603']  59.69,41.4 0 bottom
R11  10k  [0603']  59.69,36.07 0 bottom
R12  10k  [0603']  59.69,30.73 0 bottom
R13  33k  [0603']  59.69,27.18 0 bottom
R14  33k  [0603']  59.69,32.51 0 bottom
R15  33k  [0603']  59.69,37.85 0 bottom
R16  10k  [0603']  17.65,15.24 0 bottom
R17  10k  [0603']  25.27,2.54 180 bottom
R18  10k  [0603']  17.65,10.16 180 bottom
R19  [0603']  62.23,51.82 0 bottom
R20  [0603']  62.23,49.78 0 bottom
R21  [0603']  62.23,8.64 0 bottom
R22  [0603']  62.23,6.6 0 bottom
R23  [0603']  62.23,73.91 0 bottom
R24  [0603']  62.23,75.95 0 bottom
R25  [0603']  48.26,75.95 0 bottom
R26  [0603']  48.26,51.82 0 bottom
R27  [0603']  48.26,8.64 0 bottom
R28  [0603']  47.75,26.42 180 bottom
R29  [0603']  47.75,24.51 0 bottom
R30  [0603']  25.27,40.64 180 bottom
R31  [0603']  25.27,43.18 180 bottom
U1  21.46,26.67 180 top
U$1  25.4,73.03 0 top
U$2  25.4,90.81 0 top

### Tracks (layer width: path | path; a pad name or v marks a point on that pad's centre or on a via)
3V3  (via drill 0.35)
  Top 0.203: v53.85,73.66 v53.85,49.4 54.61,48.64 54.61,6.48 v53.85,5.71
  Top 0.305: U1.P$20 29.08,63.88 arc-90 31.62,66.42 U$1.OUT+.2
  Top 0.508: PAD5.1 6.99,75.56 JP8.2
  Route15 0.305: U$1.OUT+.2 U$1.OUT+.1 39.33,68.96 arc45 41.13,69.7 44.59,73.17 arc-45 46.39,73.91 v48.26,73.91
  Bottom 0.203: IC6.5 IC6.6 | IC6.5 51.67,72.79 52.58,71.88 C23.1 53.85,71.89 v53.85,73.66 | IC7.6 IC7.5 51.67,48.66 52.58,47.75 53.72,47.75 | 53.72,47.75 C22.1 | 51.63,73.91 IC6.5 | v53.85,49.4 53.85,47.88 53.72,47.75 | v53.85,5.71 53.85,4.58 C21.1 52.58,4.57 51.67,5.48 IC8.5 IC8.6 | U1.P$23 C7.1 | C7.1 16.88,8.37 17.4,8.89 17.91,8.89 18.47,9.45 R18.2 R16.1 | C7.1 16.88,5.47 19.81,2.54 R17.1 | U1.P$20 C8.1 26.05,47.64 24.46,46.05 R31.1 R30.1
  Bottom 0.305: v48.26,73.91 51.63,73.91
  Bottom 0.406: JP2.6 9.27,2.54 10.16,3.43 10.16,7.62 | JP8.2 9.53,74.93 10.16,74.3 10.16,53.34 | 10.16,7.62 10.16,19.05 | 10.16,19.05 10.16,30.35 | 10.16,30.35 10.16,41.91 | 10.16,41.91 10.16,53.34 | JP1.5 10.16,41.91 | JP3.4 10.03,30.48 10.16,30.35 | JP4.4 10.16,19.05 | U1.P$23 10.16,7.62 | U1.P$20 29.08,52.2 27.94,53.34 10.16,53.34
12V
  Top 0.508: PAD3.1 6.99,85.72 JP7.2
  Route15 0.305: D3.A 50.8,15.24 50.16,15.88 50.16,55.24 50.8,55.88 D2.A 50.8,58.42 50.16,59.05 50.16,79.38 50.8,80.01 D1.A 50.8,82.55 arc90 49.15,84.2 U$2.OUT+.2 | JP7.2 10.05,82.66 arc45 11.85,81.92 21.81,81.92 arc45 23.6,82.66 24.4,83.46 arc-45 26.2,84.2 U$2.OUT+.2 | U$2.OUT+.2 U$2.OUT+.1
  Bottom 0.203: IC1.1 51.31,84.45 50.88,84.89 C6.2 49.53,83.82 50.8,82.55 D1.A | IC2.1 51.69,60.33 51.26,60.76 C4.2 49.53,59.69 50.8,58.42 D2.A | IC3.1 51.56,17.14 51.13,17.57 C3.2 49.53,16.51 50.8,15.24 D3.A
24V  (via drill 0.35)
  Top 0.508: PAD1.1 6.99,95.89 JP6.2 9.53,95.25 arc-90 10.79,93.98 10.79,88.01 arc90 12.06,86.74 U$2.IN+.1 | U$2.IN+.1 U$2.IN+.2 | U$1.IN+.2 U$1.IN+.1 18.16,68.96 arc90 19.68,70.48 19.68,84.84 arc90 17.78,86.74 U$2.IN+.1
  Route15 0.508: 86.3,10.29 75.06,10.29 68.58,3.81 59.69,3.81 55.88,7.62 55.88,20.45 v51.44,24.89 51.44,37.47 55.24,41.27 55.24,84.45 48.26,91.44 11.43,91.44 JP6.2
  Bottom 0.203: v51.44,24.89 IC5.8 | IC5.8 51.44,28.7 52.07,29.34 52.07,34.54 51.44,35.18 IC4.8 | R28.2 48.65,26.5 IC5.8
  other vias: 93.66,74.42 93.66,73.28 93.66,72.01 93.66,70.74 93.66,69.47 93.66,68.2 92.58,68.2 92.58,69.47 92.58,70.74 92.58,72.01 92.58,73.28 92.58,74.42 91.44,74.42 91.44,73.28 91.44,72.01 91.44,70.74 91.44,69.47 91.44,68.2 93.66,43.94 93.66,42.8 93.66,41.53 93.66,40.26 93.66,38.99 93.66,37.72 92.58,37.72 92.58,38.99 92.58,40.26 92.58,41.53 92.58,42.8 92.58,43.94 91.44,43.94 91.44,42.8 91.44,41.53 91.44,40.26 91.44,38.99 91.44,37.72 93.66,13.46 93.66,12.32 93.66,11.05 93.66,9.78 93.66,8.51 93.66,7.24 92.58,7.24 92.58,8.51 92.58,9.78 92.58,11.05 92.58,12.32 92.58,13.46 91.44,13.46 91.44,12.32 91.44,11.05 91.44,9.78 91.44,8.51 91.44,7.24 86.36,73.66 90.17,74.3 88.9,72.39 86.36,72.39 90.17,71.75 87.63,71.75 86.36,71.12 88.9,71.12 86.36,69.85 87.63,70.48 90.17,70.48 90.17,73.03 87.63,69.22 85.09,69.22 86.36,68.58 85.09,70.48 87.63,74.3 88.9,73.66 87.63,73.03 85.09,73.03 85.09,74.3 85.09,71.75 88.9,68.58 88.9,69.85 90.17,69.22 83.82,68.58 83.82,69.79 83.82,71.12 83.82,72.39 83.82,73.66 87,71.75 87,72.39 87.63,72.39 87,73.03 88.27,72.39 88.27,73.03 88.27,71.75 86.36,12.7 90.17,13.34 88.9,11.43 86.36,11.43 90.17,10.79 87.63,10.79 86.36,10.16 88.9,10.16 86.36,8.89 87.63,9.53 90.17,9.53 90.17,12.06 87.63,8.26 85.09,8.26 86.36,7.62 85.09,9.53 87.63,13.34 88.9,12.7 87.63,12.06 85.09,12.06 85.09,13.34 85.09,10.79 88.9,7.62 88.9,8.89 90.17,8.26 83.82,7.62 83.82,8.83 83.82,10.16 83.82,11.43 83.82,12.7 87,10.79 87,11.43 87.63,11.43 87,12.06 88.27,11.43 88.27,12.06 88.27,10.79 86.36,43.18 90.17,43.81 88.9,41.91 86.36,41.91 90.17,41.27 87.63,41.27 86.36,40.64 88.9,40.64 86.36,39.37 87.63,40.01 90.17,40.01 90.17,42.55 87.63,38.73 85.09,38.73 86.36,38.1 85.09,40.01 87.63,43.81 88.9,43.18 87.63,42.55 85.09,42.55 85.09,43.81 85.09,41.27 88.9,38.1 88.9,39.37 90.17,38.73 83.82,38.1 83.82,39.31 83.82,40.64 83.82,41.91 83.82,43.18 87,41.27 87,41.91 87.63,41.91 87,42.55 88.27,41.91 88.27,42.55 88.27,41.27 93.03,96.84 93.66,96.2 93.03,96.2 93.66,95.57 93.66,94.93 93.03,94.93 93.03,95.57 92.39,96.2 93.66,96.84 92.39,96.84 92.39,95.57 92.39,94.93 92.39,97.47 93.03,97.47 93.66,97.47
  pour Top (isolate 0.457, rank 5, no thermals): 83.31,-0.25 100.33,-0.25 100.33,14.99 95,14.99 95,25.65 100.33,25.65 100.33,45.47 95,45.47 95,56.13 100.33,56.13 100.33,75.95 95,75.95 95,86.61 100.33,86.61 100.33,100.33 83.31,100.33
  pour Bottom (isolate 0.457, rank 5, no thermals): 74.93,14.22 74.93,6.6 100.33,6.6 100.33,14.22
  pour Bottom (isolate 0.457, rank 5, no thermals): 74.93,44.7 74.93,37.08 100.33,37.08 100.33,44.7
  pour Bottom (isolate 0.457, rank 5, no thermals): 74.93,75.18 74.93,67.56 100.33,67.56 100.33,75.18
  pour Route15 (isolate 0.457, rank 5, no thermals): 83.31,-0.25 100.33,-0.25 100.33,14.99 95,14.99 95,25.65 100.33,25.65 100.33,45.47 95,45.47 95,56.13 100.33,56.13 100.33,75.95 95,75.95 95,86.61 100.33,86.61 100.33,100.33 83.31,100.33
  pour Route2 (isolate 0.457, rank 5, no thermals): 83.31,-0.25 100.33,-0.25 100.33,14.99 95,14.99 95,25.65 100.33,25.65 100.33,45.47 95,45.47 95,56.13 100.33,56.13 100.33,75.95 95,75.95 95,86.61 100.33,86.61 100.33,100.33 83.31,100.33
  pour Bottom (isolate 0.457, no thermals): 92.01,97.85 92.01,94.55 94.04,94.55 94.04,97.85
A  (via drill 0.35)
  Route15 0.203: v61.6,39.62 59.18,39.62 58.04,40.77 58.04,74.93 59.05,75.95 v64.14,75.95 65.66,75.95 66.42,76.71 87.88,76.71 v88.65,77.47
  Bottom 0.203: IC1.6 60.58,87 60.78,87.2 C1.2 64.06,87.2 64.9,86.36 64.9,76.2 64.64,75.95 v64.14,75.95 R24.1 | v61.6,39.62 R8.1
  pour Bottom (isolate 0.457, no thermals): 74.93,88.9 74.93,80.01 77.72,80.01 77.72,76.2 84.07,76.2 84.07,80.01 86.61,80.01 86.61,76.2 93.98,76.2 93.98,88.9
A_IN+
  Bottom 0.203: R24.2 60.71,75.95 60.47,75.7 C15.1 58.94,75.7 58.49,75.25 IC6.2
A_IN-
  Bottom 0.203: R23.2 60.71,73.91 60.47,74.16 C15.2 58.94,74.16 58.49,74.61 IC6.3
A_OUT_SEN
  Bottom 0.203: IC6.8 49.12,75.91 R25.1
A_SEN  (via drill 0.35)
  Top 0.203: JP9.2 39.37,38.1 arc90 41.91,40.64 41.91,73.41 arc-90 44.45,75.95 v45.72,75.95
  Route15 0.203: JP9.2 33.92,38.1 arc45 32.38,37.47 arc-45 30.85,36.83 28.36,36.83 arc45 26.56,36.09 21.7,31.22 arc-45 19.9,30.48 U1.P$32
  Bottom 0.203: U1.P$32 C20.1 | v45.72,75.95 R25.2
AP  (via drill 0.35)
  Route15 0.203: v95.63,76.58 95,76.58 94.61,76.2 66.67,76.2 66.04,75.56 66.04,74.55 65.41,73.91 v64.14,73.91
  Bottom 0.203: v64.14,73.91 R23.1
  other vias: 95.63,85.98 95.63,85.34 96.27,85.98 96.27,85.34 96.9,85.98 95.63,84.71 95.63,81.28 95.63,81.92 95.63,80.64 96.27,76.58 95.63,77.22 96.27,77.22 95.63,77.85 96.9,76.58 97.92,77.34 98.55,77.34 98.55,77.98 97.92,77.98 97.92,78.74 98.55,78.74 98.55,80.01 97.92,80.01 97.92,79.38 98.55,79.38 98.55,82.42 97.92,82.42 97.92,83.06 98.55,83.06 98.55,83.82 97.92,83.82 97.92,85.22 98.55,85.22 98.55,84.58 97.92,84.58 98.55,80.64 98.55,81.79 97.92,81.79 97.92,80.64 98.23,81.28 96.27,81.28 97.54,81.28 96.9,81.28
  pour Bottom (isolate 0.457, rank 2, no thermals): 95.25,76.2 95.25,88.14 100.33,88.14 100.33,76.2
  pour Top (isolate 0.457, rank 2, no thermals): 95.25,76.2 95.25,86.36 100.33,86.36 100.33,76.2
  pour Route15 (isolate 0.457, rank 2, no thermals): 95.25,76.2 95.25,86.36 100.33,86.36 100.33,76.2
  pour Route2 (isolate 0.457, rank 2, no thermals): 95.25,76.2 95.25,86.36 100.33,86.36 100.33,76.2
B  (via drill 0.35)
  Route15 0.203: v64.26,51.82 65.79,51.82 66.42,51.18 66.42,46.74 66.93,46.23 87.88,46.23 v88.65,46.99
  Bottom 0.203: IC2.6 60.33,62.87 60.53,63.07 C2.2 64.18,63.07 65.02,62.23 65.02,52.07 64.77,51.82 v64.26,51.82 R19.1 62.48,51.82 62.23,51.56 62.23,34.67 61.85,34.29 R7.1
  pour Bottom (isolate 0.457, no thermals): 74.93,58.42 74.93,49.53 77.72,49.53 77.72,45.72 84.07,45.72 84.07,49.53 86.61,49.53 86.61,45.72 93.98,45.72 93.98,58.42
B_IN+
  Bottom 0.203: R19.2 60.71,51.82 60.47,51.58 C16.1 58.94,51.58 58.49,51.12 IC7.2
B_IN-
  Bottom 0.203: R20.2 60.71,49.78 60.47,50.02 C16.2 58.94,50.02 58.49,50.48 IC7.3
B_OUT_SEN
  Bottom 0.203: IC7.8 49.12,51.77 R26.1
B_SEN  (via drill 0.35)
  Top 0.203: JP9.3 40.01,35.56 arc90 42.55,38.1 42.55,49.28 arc-90 45.09,51.82 v45.72,51.82
  Route15 0.203: JP9.3 33.92,35.56 arc45 32.38,34.92 arc-45 30.85,34.29 28.36,34.29 arc45 26.56,33.55 21.7,28.68 arc-45 19.9,27.94 U1.P$31
  Bottom 0.203: 47.48,51.77 R26.2 v45.72,51.82 | U1.P$31 C19.1
BEMF_A
  Bottom 0.203: R15.2 58.88,39.5 | 58.88,39.5 R8.2 R10.2 | IC4.3 53.98,40.77 arc90 55.12,39.62 58.75,39.62 arc-90 58.88,39.5
BEMF_B
  Bottom 0.203: R14.2 R7.2 R11.2 57.53,36.07 56.94,36.66 IC4.5
BEMF_C
  Bottom 0.203: R13.2 R9.2 R12.2 54.23,30.73 arc-90 53.98,30.99 IC5.3
BP  (via drill 0.35)
  Route15 0.203: v95.63,46.1 95.12,46.1 94.74,45.72 66.67,45.72 65.91,46.48 65.91,49.28 65.41,49.78 v64.26,49.78
  Bottom 0.203: v64.26,49.78 R20.1
  other vias: 95.63,55.5 97.92,54.74 98.55,54.74 97.92,54.1 97.92,53.34 97.92,52.7 97.92,52.07 98.55,52.07 98.55,52.7 98.55,53.34 98.55,54.1 97.92,49.53 98.55,49.53 97.92,48.9 98.55,48.9 98.55,48.26 97.92,48.26 97.92,46.86 98.55,46.86 98.55,47.5 97.92,47.5 95.63,50.8 95.63,50.16 97.92,51.44 96.27,50.8 98.55,51.44 95.63,51.44 95.63,46.74 96.27,46.1 96.27,46.74 95.63,54.86 96.27,55.5 96.27,54.86 97.92,50.16 95.63,54.23 98.55,50.16 95.63,47.5 96.9,55.5 96.9,46.1 98.23,50.8 97.54,50.8 96.9,50.8
  pour Bottom (isolate 0.457, rank 2, no thermals): 95.25,45.72 95.25,57.66 100.33,57.66 100.33,45.72
  pour Top (isolate 0.457, rank 2, no thermals): 95.25,45.72 95.25,55.88 100.33,55.88 100.33,45.72
  pour Route15 (isolate 0.457, rank 2, no thermals): 95.25,45.72 95.25,55.88 99.31,55.88 100.33,55.88 100.33,45.72
  pour Route2 (isolate 0.457, rank 2, no thermals): 95.25,45.72 95.25,55.88 99.31,55.88 100.33,55.88 100.33,45.72
C  (via drill 0.35)
  Route15 0.203: v64.26,8.64 64.26,14.61 65.41,15.75 87.88,15.75 v88.65,16.51
  Bottom 0.203: IC3.6 60.33,19.68 60.53,19.89 C5.2 | C5.2 62.23,28.45 61.72,28.96 R9.1 | R21.1 v64.26,8.64 64.77,8.64 65.15,9.02 65.15,19.3 64.56,19.89 C5.2
  pour Bottom (isolate 0.457, no thermals): 74.93,27.94 74.93,19.05 77.72,19.05 77.72,15.24 84.07,15.24 84.07,19.05 86.61,19.05 86.61,15.24 93.98,15.24 93.98,27.94
C_IN+
  Bottom 0.203: IC8.2 58.49,7.95 58.94,8.39 C17.1 60.47,8.39 60.71,8.64 R21.2
C_IN-
  Bottom 0.203: IC8.3 58.49,7.29 58.94,6.84 C17.2 60.47,6.84 60.71,6.6 R22.2
C_OUT_SEN
  Bottom 0.203: IC8.8 49.12,8.6 R27.1
C_SEN  (via drill 0.35)
  Route15 0.203: v47.37,10.16 47.37,30.48 arc90 44.83,33.02 JP9.4 33.92,33.02 arc45 32.38,32.38 arc-45 30.85,31.75 27.09,31.75 arc45 25.29,31.01 20.43,26.14 arc-45 18.63,25.4 U1.P$30
  Bottom 0.203: U1.P$30 C18.1 | v47.37,10.16 47.37,8.71 arc90 R27.2
CP  (via drill 0.35)
  Route15 0.203: v95.63,15.62 95.25,15.24 65.66,15.24 64.77,14.35 v64.77,6.6
  Bottom 0.203: v64.77,6.6 R22.1
  other vias: 95.63,25.02 95.63,24.38 96.27,25.02 96.27,24.38 96.9,25.02 95.63,23.75 95.63,20.32 95.63,20.95 95.63,19.68 96.27,20.32 95.63,16.26 96.27,15.62 96.27,16.26 96.9,15.62 95.63,16.89 97.92,16.38 98.55,16.38 97.92,17.02 98.55,17.02 97.92,17.78 98.55,17.78 98.55,19.05 97.92,19.05 97.92,18.41 98.55,18.41 98.55,19.68 97.92,19.68 98.23,20.32 97.92,20.95 98.55,20.95 97.92,24.26 98.55,24.26 97.92,23.62 98.55,23.62 97.92,22.86 98.55,22.86 97.92,21.59 98.55,21.59 98.55,22.23 97.92,22.23 97.54,20.32 96.9,20.32
  pour Bottom (isolate 0.457, rank 2, no thermals): 95.25,15.24 95.25,27.18 100.33,27.18 100.33,15.24
  pour Top (isolate 0.457, rank 2, no thermals): 95.25,15.24 95.25,25.4 100.33,25.4 100.33,15.24
  pour Route15 (isolate 0.457, rank 2, no thermals): 95.25,15.24 95.25,25.4 100.33,25.4 100.33,15.24
  pour Route2 (isolate 0.457, rank 2, no thermals): 95.25,15.24 95.25,25.4 100.33,25.4 100.33,15.24
ENC_A
  Top 0.203: JP1.2 10.16,49.53 arc-90 11.43,48.26 11.43,38.73 arc90 12.06,38.1 U1.P$35
  Bottom 0.203: JP10.2 JP1.2
ENC_B
  Top 0.203: JP1.3 9.53,46.99 arc-90 10.79,45.72 10.79,36.83 arc90 12.06,35.56 U1.P$34
  Bottom 0.203: JP10.3 JP1.3
ENC_CS
  Top 0.203: JP2.5 8.15,4.55 arc45 9.94,3.81 23.5,3.81 arc90 24.77,5.08 24.77,22.86 arc-90 27.3,25.4 U1.P$10
  Bottom 0.203: JP11.5 JP2.5
ENC_I
  Top 0.203: JP1.4 8.89,44.45 arc-90 10.16,43.18 10.16,34.92 arc90 12.06,33.02 U1.P$33
  Bottom 0.203: JP10.4 JP1.4
GND  (via drill 0.35)
  Route15 0.508: 64.9,32 64.77,31.88 | v70.61,64.9 70.48,64.77 64.64,64.77 | v70.61,92.33 64.77,92.33 64.64,92.46
  Route15 1.016: v70.61,32 64.9,32
  Bottom 0.203: C6.1 50.88,87.83 51.31,88.27 IC1.4 | C4.1 51.26,63.7 51.69,64.14 IC2.4
  other vias: 72.83,35.69 72.83,34.54 72.83,33.27 72.83,32 72.83,30.73 72.83,29.46 71.75,29.46 71.75,30.73 71.75,32 71.75,33.27 71.75,34.54 71.75,35.69 70.61,35.69 70.61,34.54 70.61,33.27 70.61,30.73 70.61,29.46 72.83,66.04 72.83,64.9 72.83,63.63 72.83,62.36 72.83,61.09 72.83,59.82 71.75,59.82 71.75,61.09 71.75,62.36 71.75,63.63 71.75,64.9 71.75,66.04 70.61,66.04 70.61,63.63 70.61,62.36 70.61,61.09 70.61,59.82 72.83,97.28 72.83,96.14 72.83,94.87 72.83,93.6 72.83,92.33 72.83,91.06 71.75,91.06 71.75,92.33 71.75,93.6 71.75,94.87 71.75,96.14 71.75,97.28 70.61,97.28 70.61,96.14 70.61,94.87 70.61,93.6 70.61,91.06 55.88,34.29 71.12,48.26 72.39,48.26 71.12,46.99 72.39,46.99 71.12,54.61 72.39,54.61 71.12,55.88 72.39,55.88 71.12,77.47 72.39,77.47 72.39,78.74 71.12,78.74 71.12,86.36 72.39,86.36 72.39,85.09 71.12,85.09 71.12,18.92 72.39,18.92 71.12,17.14 72.39,17.14 71.12,13.97 72.39,13.97 72.39,12.7 71.12,12.7 71.12,2.54 72.39,2.54 72.39,3.81 71.12,3.81 80.39,32 81.53,32 80.96,31.62 80.39,31.24 81.53,31.24 80.96,30.86 80.39,30.48 81.53,30.48 80.96,30.1 82.04,30.04 82.11,30.86 82.11,31.62 81.47,29.65 79.82,30.1 80.39,29.72 79.82,30.86 79.82,31.62 79.82,32.38 80.96,32.38 82.11,32.38 81.53,32.77 80.39,32.77 80.39,62.48 81.53,62.48 80.96,62.1 80.39,61.72 81.53,61.72 80.96,61.34 80.39,60.96 81.53,60.96 80.96,60.58 82.04,60.52 82.11,61.34 82.11,62.1 81.47,60.13 79.82,60.58 80.39,60.2 79.82,61.34 79.82,62.1 79.82,62.87 80.96,62.87 82.11,62.87 81.53,63.25 80.39,63.25 80.39,92.96 81.53,92.96 80.96,92.58 80.39,92.2 81.53,92.2 80.96,91.82 80.39,91.44 81.53,91.44 80.96,91.06 82.04,91 82.11,91.82 82.11,92.58 81.47,90.61 79.82,91.06 80.39,90.68 79.82,91.82 79.82,92.58 79.82,93.34 80.96,93.34 82.11,93.34 81.53,93.73 80.39,93.73
  pour Top (isolate 0.457, rank 6, no thermals): 83.06,-0.25 83.06,100.33 67.31,100.33 67.31,-0.25
  pour Bottom (isolate 0.457, rank 6, no thermals): 100.33,-0.25 100.33,6.35 74.68,6.35 74.68,28.19 100.33,28.19 100.33,36.83 74.68,36.83 74.68,58.67 100.33,58.67 100.33,67.31 74.68,67.31 74.68,89.15 100.33,89.15 100.33,100.33 67.31,100.33 67.31,-0.25
  pour Route15 (isolate 0.457, rank 6, no thermals): 83.06,-0.25 83.06,100.33 67.31,100.33 67.31,-0.25
  pour Route2 (isolate 0.457, rank 6, no thermals): 83.06,-0.25 83.06,100.33 67.31,100.33 67.31,-0.25
  pour Bottom (isolate 0.254, rank 6): 66.04,-1.27 -1.27,-1.27 -1.27,101.6 66.04,101.6
  pour Top (isolate 0.254, rank 6): 66.04,-1.4 -1.27,-1.4 -1.27,101.6 66.04,101.6
  pour Route2 (isolate 0.254, rank 6): 66.04,-1.27 -1.27,-1.27 -1.27,101.6 66.04,101.6
  pour Route15 (isolate 0.254, rank 6): 66.04,-1.27 -1.27,-1.27 -1.27,101.6 66.04,101.6
HIN_A
  Bottom 0.203: IC1.2 51.69,85.72 51.44,85.98 42.55,85.98 arc90 40.01,83.44 40.01,21.59 arc-90 38.73,20.32 JP5.3 33.76,18.52 arc-45 31.97,17.78 U1.P$7
HIN_B
  Bottom 0.203: IC2.2 51.69,61.59 51.44,61.85 43.81,61.85 arc90 41.27,59.31 41.27,16.51 arc-90 40.01,15.24 JP5.5 U1.P$6
HIN_C
  Bottom 0.203: IC3.2 51.69,18.41 51.44,18.67 45.09,18.67 arc90 42.55,16.13 42.55,11.43 arc-90 41.27,10.16 35.69,10.16 | JP5.7 35.69,10.16 | U1.P$5 32.09,12.7 arc-45 33.89,11.96 35.69,10.16
HO_A  (via drill 0.35)
  Route15 0.203: Q4.1 76.44,87.01 75.69,87.76 63.75,87.76 61.72,85.72 v60.33,85.72
  Bottom 0.203: Q3.1 85.33,76.57 arc-90 84.84,76.07 76.96,76.07 arc-90 76.45,76.58 76.45,78.22 arc90 Q4.1 | v60.33,85.72 IC1.7
  other vias: 76.44,78.23
HO_B  (via drill 0.35)
  Route15 0.203: Q9.1 76.44,57.29 75.82,57.91 65.79,57.91 62.1,61.59 v60.33,61.59
  Bottom 0.203: Q6.1 85.33,46.09 arc-90 84.84,45.59 76.96,45.59 arc-90 76.45,46.1 76.45,47.74 arc90 Q9.1 | v60.33,61.59 IC2.7
  other vias: 76.44,47.76
HO_C  (via drill 0.35)
  Route15 0.203: v76.45,17.27 76.45,19.56 75.69,20.32 65.15,20.32 63.25,18.41 v60.33,18.41
  Bottom 0.203: Q10.1 85.33,15.73 arc-90 84.71,15.11 77.09,15.11 arc-90 76.45,15.75 v76.45,17.26 arc90 Q15.1 v76.45,17.27 | v60.33,18.41 IC3.7
LIN_A
  Top 0.203: U1.P$4 31.11,10.16 arc90 32.38,11.43 32.38,20.95 arc-90 34.29,22.86 JP5.2
  Bottom 0.203: IC1.3 51.69,87 51.44,86.74 41.91,86.74 arc90 39.37,84.2 39.37,24.13 arc-90 38.1,22.86 JP5.2
LIN_B
  Top 0.203: U1.P$3 31.75,7.62 arc90 33.02,8.89 33.02,16.51 arc-90 34.29,17.78 JP5.4
  Bottom 0.203: IC2.3 51.69,62.87 51.44,62.61 43.18,62.61 arc90 40.64,60.07 40.64,19.05 arc-90 39.37,17.78 JP5.4
LIN_C
  Top 0.203: U1.P$2 32.38,5.08 arc90 33.66,6.35 33.66,11.81 arc-90 34.54,12.7 JP5.6
  Bottom 0.203: IC3.3 51.69,19.68 51.44,19.43 44.45,19.43 arc90 41.91,16.89 41.91,13.97 arc-90 40.64,12.7 JP5.6
LO_A  (via drill 0.35)
  Route15 0.203: Q1.1 76.44,89.01 75.69,88.27 v60.33,88.27
  Bottom 0.203: Q1.1 76.44,90.69 arc90 77.34,89.79 84.45,89.79 arc90 85.34,90.68 85.34,92.19 arc90 Q2.1 | v60.33,88.27 IC1.5
  other vias: 76.44,92.2
LO_B  (via drill 0.35)
  Route15 0.203: Q7.1 76.44,59.04 75.82,58.42 66.04,58.42 v60.33,64.14
  Bottom 0.203: Q5.1 85.33,59.93 arc-90 84.71,59.31 77.09,59.31 arc-90 76.45,59.94 76.45,61.71 arc90 Q7.1 | v60.33,64.14 IC2.5
  other vias: 76.44,61.73
LO_C  (via drill 0.35)
  Route15 0.203: v60.24,20.95 75.69,20.95 76.45,21.72 v76.45,31.24
  Bottom 0.203: Q8.1 85.33,29.7 arc-90 84.45,28.83 77.34,28.83 arc-90 76.45,29.72 v76.45,31.23 arc90 Q13.1 v76.45,31.25 v76.45,31.24 | v60.24,20.95 IC3.5
MISO
  Top 0.203: JP2.3 8.15,9.63 arc45 9.94,8.89 22.23,8.89 arc90 23.5,10.16 23.5,27.94 arc-90 26.04,30.48 U1.P$12
  Bottom 0.203: JP11.3 JP2.3
MOSI
  Top 0.203: JP2.2 8.15,12.17 arc45 9.94,11.43 21.59,11.43 arc90 22.86,12.7 22.86,30.48 arc-90 25.4,33.02 U1.P$13
  Bottom 0.203: JP11.2 JP2.2
O_BEMF_A  (via drill 0.35)
  Top 0.203: JP5.10 38.73,2.54 arc90 41.27,5.08 41.27,27.3 arc-90 43.18,29.21 51.44,29.21 arc90 53.98,31.75 53.98,38.1 arc90 53.34,38.73 52.07,38.73 arc-90 51.44,39.37 v51.44,40.26
  Route15 0.203: JP5.10 37.02,4 arc45 37.47,5.08 37.47,7.62 arc90 36.2,8.89 25.4,8.89 arc-90 24.13,10.16 24.13,13.97 arc90 22.86,15.24 U1.P$26
  Bottom 0.203: IC4.1 51.39,42.04 arc-90 51.44,41.99 v51.44,40.26 | U1.P$26 R16.2
O_BEMF_B  (via drill 0.35)
  Top 0.203: JP5.9 38.1,5.08 arc90 40.64,7.62 40.64,27.94 arc-90 43.18,30.48 50.16,30.48 arc90 52.7,33.02 v52.7,35.05
  Route15 0.203: U1.P$24 22.23,10.16 arc-90 23.5,8.89 23.5,7.62 arc90 24.77,6.35 33.39,6.35 arc-45 34.92,5.71 JP5.9
  Bottom 0.203: v52.7,35.05 IC4.7 | U1.P$24 R18.1
O_BEMF_C  (via drill 0.35)
  Top 0.203: JP5.8 38.73,7.62 arc90 40.01,8.89 40.01,29.34 arc-90 42.55,31.88 v48.26,31.88
  Bottom 0.203: v48.26,31.88 51.39,31.88 IC5.1 | R17.2 U1.P$1 33.02,2.54 34.29,3.81 34.29,6.35 JP5.8
PA7
  Top 0.203: U1.P$28 19.68,20.32 arc90 20.95,21.59 20.95,53.34 arc90 18.41,55.88 JP15.4
  Bottom 0.203: JP14.4 JP15.4
PB0
  Top 0.203: U1.P$27 20.32,17.78 arc90 21.59,19.05 21.59,55.88 arc90 19.05,58.42 JP15.3
  Bottom 0.203: JP14.3 JP15.3
PB2
  Top 0.203: U1.P$25 20.95,12.7 arc90 22.23,13.97 22.23,58.42 arc90 19.68,60.96 JP15.2
  Bottom 0.203: JP14.2 JP15.2
REF_BEMF
  Bottom 0.203: 59.94,27.18 R13.1 60.47,27.14 | 59.94,27.18 59.69,27.43 59.69,32.51 | 59.69,32.51 59.69,37.59 59.94,37.85 R15.1 | R14.1 59.69,32.51 | 59.94,27.18 arc90 59.69,26.92 59.69,25.65 arc-90 59.44,25.4 C24.1 57.78,25.4 arc-90 57.15,26.04 57.15,29.08 arc90 56.39,29.84 53.47,29.84 arc-90 52.7,30.61 IC5.2 52.7,33.12 arc-45 53.09,34.04 53.62,34.57 arc45 53.98,35.43 IC4.6 53.98,38.35 arc45 53.71,39 52.96,39.75 arc-45 52.7,40.36 IC4.2
RX
  Route15 0.203: U1.P$15 27.3,38.1 arc45 26.22,37.65 21.06,32.49 arc-45 19.27,31.75 12.06,31.75 arc90 10.79,30.48 10.79,25.4 arc-90 9.53,24.13 JP4.2
  Bottom 0.203: JP13.2 JP4.2
SCK
  Top 0.203: JP2.4 8.15,7.09 arc45 9.94,6.35 22.86,6.35 arc90 24.13,7.62 24.13,25.4 arc-90 26.67,27.94 U1.P$11
  Bottom 0.203: JP11.4 JP2.4
SCL
  Route15 0.203: JP3.3 8.15,33.55 arc-45 9.94,34.29 18,34.29 arc45 19.79,35.03 24.66,39.9 arc-45 26.45,40.64 U1.P$16
  Bottom 0.203: R30.2 U1.P$16 | JP12.3 JP3.3
SDA
  Route15 0.203: JP3.2 8.15,36.09 arc-45 9.94,36.83 17.36,36.83 arc45 19.16,37.57 24.02,42.44 arc-45 25.82,43.18 U1.P$17
  Bottom 0.203: R31.2 U1.P$17 | JP12.2 JP3.2
TX
  Route15 0.203: JP4.3 10.16,21.59 arc90 11.43,22.86 11.43,27.94 arc-90 12.7,29.21 19.9,29.21 arc45 21.7,29.95 26.56,34.82 arc-45 28.36,35.56 U1.P$14
  Bottom 0.203: JP13.3 JP4.3
V_SEN  (via drill 0.35)
  Route15 0.203: v45.47,26.42 40.39,26.42 arc-90 39.37,27.43 39.37,29.21 arc90 38.1,30.48 JP9.5 33.92,30.48 arc45 32.38,29.84 arc-45 30.85,29.21 25.82,29.21 arc45 24.02,28.47 19.16,23.6 arc-45 17.36,22.86 U1.P$29
  Bottom 0.203: R29.2 R28.1 v45.47,26.42 | U1.P$29 C29.1
VB_A
  Bottom 0.203: D1.C 60.96,82.04 62.23,83.31 C1.1 60.53,84.25 60.33,84.45 IC1.8
VB_B
  Bottom 0.203: D2.C 60.96,58.04 62.23,59.31 C2.1 60.4,60.12 60.2,60.33 IC2.8
VB_C
  Bottom 0.203: IC3.8 60.2,17.14 60.4,16.94 C5.1 62.23,16.13 60.96,14.86 D3.C

### Text on the board
tNames: 24V / / / GND | 12V / REG | 12V / / / GND | 3V3 / / / GND | 3V3 / REG | GND / PB2 / PB0 / PA7 | ABI | GND / A_SEN / B_SEN / C_SEN / V_SEN | I2C | UART | GND / LIN_A / HIN_A / LIN_B / HIN_B / LIN_C / HIN_C / BEMF_C / BEMF_B / BEMF_C | SPI